# EAGLE schematic QuDAC_V3 (EAGLE 6.6.0)

## Sheet 1 of 14
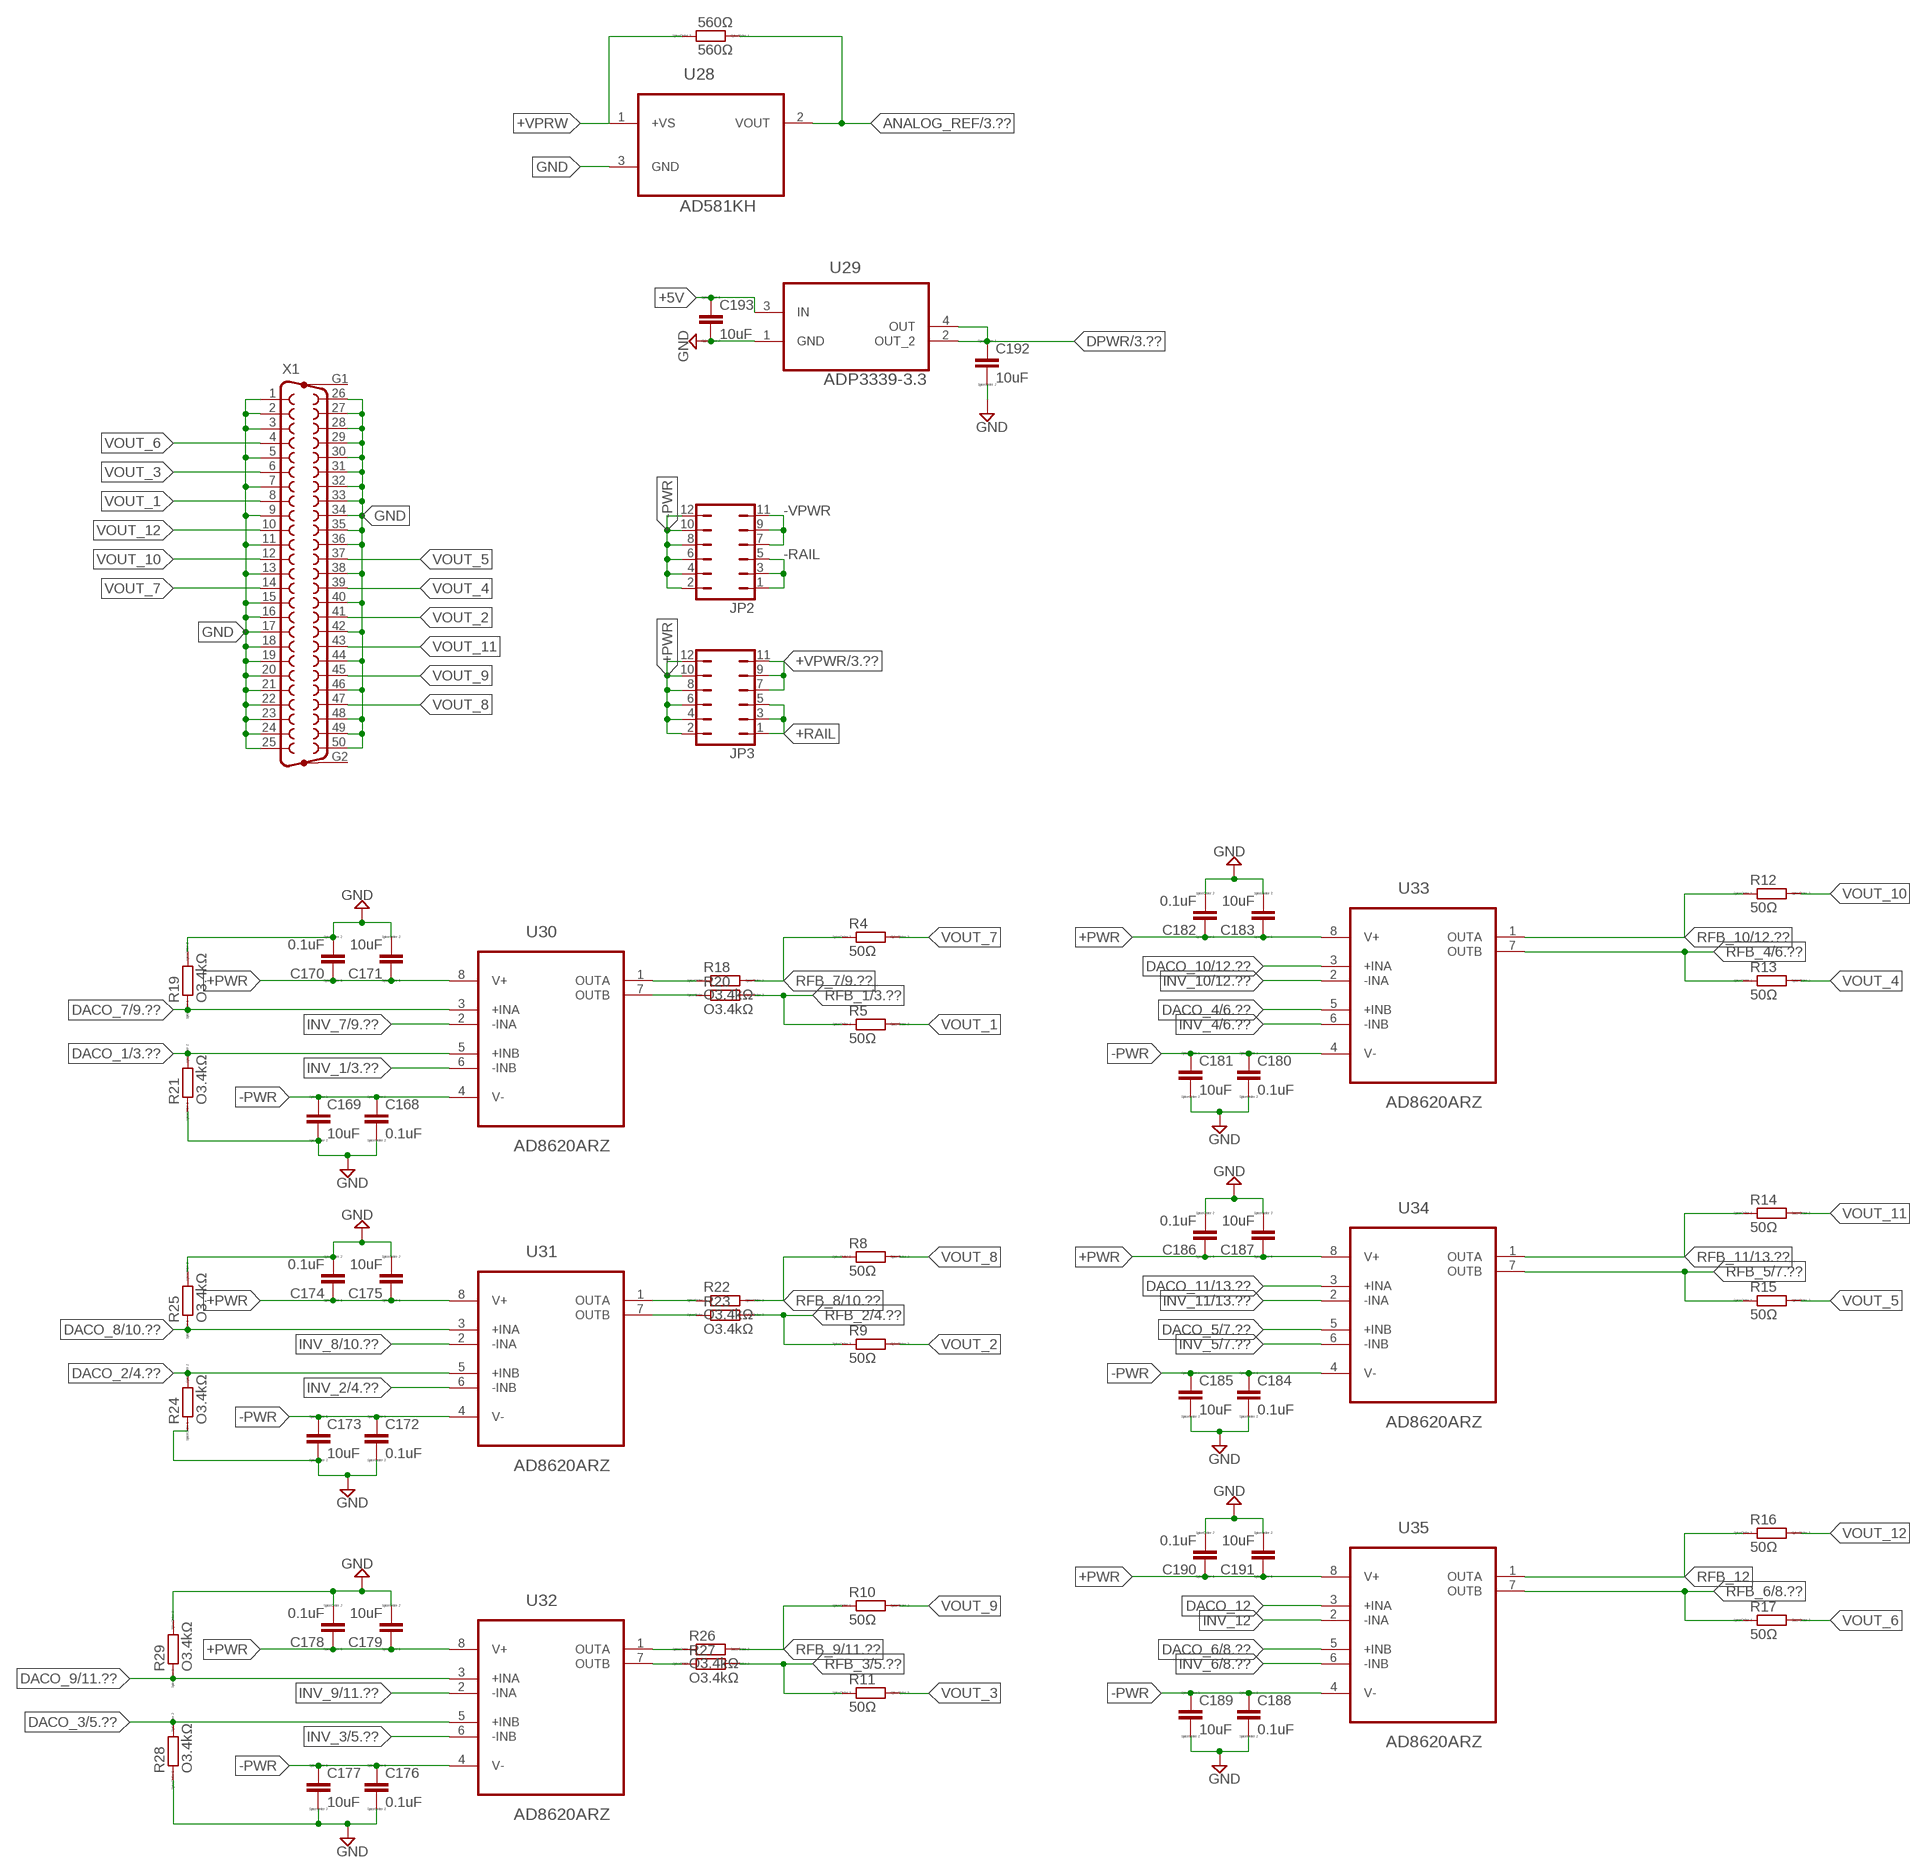
[diagram p0: schematic, sheet 1]

### Parts
560Ω  560Ω  RR0603  [R0603]
C168  0.1uF  CC0603  [C0603]
C169  10uF  C  [C0805]
C170  0.1uF  CC0603  [C0603]
C171  10uF  C  [C0805]
C172  0.1uF  CC0603  [C0603]
C173  10uF  C  [C0805]
C174  0.1uF  CC0603  [C0603]
C175  10uF  C  [C0805]
C176  0.1uF  CC0603  [C0603]
C177  10uF  C  [C0805]
C178  0.1uF  CC0603  [C0603]
C179  10uF  C  [C0805]
C180  0.1uF  CC0603  [C0603]
C181  10uF  C  [C0805]
C182  0.1uF  CC0603  [C0603]
C183  10uF  C  [C0805]
C184  0.1uF  CC0603  [C0603]
C185  10uF  C  [C0805]
C186  0.1uF  CC0603  [C0603]
C187  10uF  C  [C0805]
C188  0.1uF  CC0603  [C0603]
C189  10uF  C  [C0805]
C190  0.1uF  CC0603  [C0603]
C191  10uF  C  [C0805]
C192  10uF  C  [C0805]
C193  10uF  C  [C0805]
JP2  JP6Q  [JP6Q]
JP3  JP6Q  [JP6Q]
R4  50Ω  RR0603  [R0603]
R5  50Ω  RR0603  [R0603]
R8  50Ω  RR0603  [R0603]
R9  50Ω  RR0603  [R0603]
R10  50Ω  RR0603  [R0603]
R11  50Ω  RR0603  [R0603]
R12  50Ω  RR0603  [R0603]
R13  50Ω  RR0603  [R0603]
R14  50Ω  RR0603  [R0603]
R15  50Ω  RR0603  [R0603]
R16  50Ω  RR0603  [R0603]
R17  50Ω  RR0603  [R0603]
R18  O3.4kΩ  RR0603  [R0603]
R19  O3.4kΩ  RR0603  [R0603]
R20  O3.4kΩ  RR0603  [R0603]
R21  O3.4kΩ  RR0603  [R0603]
R22  O3.4kΩ  RR0603  [R0603]
R23  O3.4kΩ  RR0603  [R0603]
R24  O3.4kΩ  RR0603  [R0603]
R25  O3.4kΩ  RR0603  [R0603]
R26  O3.4kΩ  RR0603  [R0603]
R27  O3.4kΩ  RR0603  [R0603]
R28  O3.4kΩ  RR0603  [R0603]
R29  O3.4kΩ  RR0603  [R0603]
U28  AD581KH  [TO254P939X470-3P]
U29  ADP3339-3.3  ADP3339AKCZ-3.3-R7  [SOT230P700X180-4N]
U30  AD8620ARZ  [SOIC127P600X175-8N]
U31  AD8620ARZ  [SOIC127P600X175-8N]
U32  AD8620ARZ  [SOIC127P600X175-8N]
U33  AD8620ARZ  [SOIC127P600X175-8N]
U34  AD8620ARZ  [SOIC127P600X175-8N]
U35  AD8620ARZ  [SOIC127P600X175-8N]
X1  F50HP  [F50HP]

### Nets
+5V: C193.1 U29.3(IN) ; also sheet 2
+PWR: C170.1 C171.1 C174.1 C175.1 C178.1 C179.1 C182.1 C183.1 C186.1 C187.1 C190.1 C191.1 JP3.2 JP3.4 JP3.6 JP3.8 JP3.10 JP3.12 U30.8(V+) U31.8(V+) U32.8(V+) U33.8(V+) U34.8(V+) U35.8(V+)
+RAIL: JP3.1 JP3.3 JP3.5 ; also sheet 2
+VPRW: 560Ω.2 U28.1(+VS)
+VPWR: JP3.7 JP3.9 JP3.11 ; also sheet 2,3,4,5,6,7,8,9,10,11,12,13,14
-PWR: C168.1 C169.1 C172.1 C173.1 C176.1 C177.1 C180.1 C181.1 C184.1 C185.1 C188.1 C189.1 JP2.2 JP2.4 JP2.6 JP2.8 JP2.10 JP2.12 U30.4(V-) U31.4(V-) U32.4(V-) U33.4(V-) U34.4(V-) U35.4(V-)
-RAIL: JP2.1 JP2.3 JP2.5 ; also sheet 2
-VPWR: JP2.7 JP2.9 JP2.11 ; also sheet 2,3,4,5,6,7,8,9,10,11,12,13,14
ANALOG_REF: 560Ω.1 U28.2(VOUT) ; also sheet 3,4,5,6,7,8,9,10,11,12,13,14
DACO_1: R21.2 U30.5(+INB) ; also sheet 3
DACO_2: R24.2 U31.5(+INB) ; also sheet 4
DACO_3: R28.2 U32.5(+INB) ; also sheet 5
DACO_4: U33.5(+INB) ; also sheet 6
DACO_5: U34.5(+INB) ; also sheet 7
DACO_6: U35.5(+INB) ; also sheet 8
DACO_7: R19.1 U30.3(+INA) ; also sheet 9
DACO_8: R25.1 U31.3(+INA) ; also sheet 10
DACO_9: R29.1 U32.3(+INA) ; also sheet 11
DACO_10: U33.3(+INA) ; also sheet 12
DACO_11: U34.3(+INA) ; also sheet 13
DACO_12: U35.3(+INA) ; also sheet 14
DPWR: C192.1 U29.2(OUT_2) U29.4(OUT) ; also sheet 2,3,4,5,6,7,8,9,10,11,12,13,14
GND: C168.2 C169.2 C170.2 C171.2 C172.2 C173.2 C174.2 C175.2 C176.2 C177.2 C178.2 C179.2 C180.2 C181.2 C182.2 C183.2 C184.2 C185.2 C186.2 C187.2 C188.2 C189.2 C190.2 C191.2 C192.2 C193.2 R19.2 R21.1 R24.1 R25.2 R28.1 R29.2 U28.3(GND) U29.1(GND) X1.1 X1.2 X1.3 X1.5 X1.7 X1.9 X1.11 X1.13 X1.15 X1.16 X1.17 X1.18 X1.19 X1.20 X1.21 X1.22 X1.23 X1.24 X1.25 X1.26 X1.27 X1.28 X1.29 X1.30 X1.31 X1.32 X1.33 X1.34 X1.35 X1.36 X1.38 X1.40 X1.42 X1.44 X1.46 X1.48 X1.49 X1.50 ; also sheet 2,3,4,5,6,7,8,9,10,11,12,13,14
INV_1: U30.6(-INB) ; also sheet 3
INV_2: U31.6(-INB) ; also sheet 4
INV_3: U32.6(-INB) ; also sheet 5
INV_4: U33.6(-INB) ; also sheet 6
INV_5: U34.6(-INB) ; also sheet 7
INV_6: U35.6(-INB) ; also sheet 8
INV_7: U30.2(-INA) ; also sheet 9
INV_8: U31.2(-INA) ; also sheet 10
INV_9: U32.2(-INA) ; also sheet 11
INV_10: U33.2(-INA) ; also sheet 12
INV_11: U34.2(-INA) ; also sheet 13
INV_12: U35.2(-INA) ; also sheet 14
N$9: R18.1 U30.1(OUTA)
N$10: R20.1 U30.7(OUTB)
N$11: R23.1 U31.7(OUTB)
N$16: R22.1 U31.1(OUTA)
N$23: R26.1 U32.1(OUTA)
N$24: R27.1 U32.7(OUTB)
RFB_1: R5.1 R20.2 ; also sheet 3
RFB_2: R9.1 R23.2 ; also sheet 4
RFB_3: R11.1 R27.2 ; also sheet 5
RFB_4: R13.1 U33.7(OUTB) ; also sheet 6
RFB_5: R15.1 U34.7(OUTB) ; also sheet 7
RFB_6: R17.1 U35.7(OUTB) ; also sheet 8
RFB_7: R4.1 R18.2 ; also sheet 9
RFB_8: R8.1 R22.2 ; also sheet 10
RFB_9: R10.1 R26.2 ; also sheet 11
RFB_10: R12.1 U33.1(OUTA) ; also sheet 12
RFB_11: R14.1 U34.1(OUTA) ; also sheet 13
RFB_12: R16.1 U35.1(OUTA) ; also sheet 14
VOUT_1: R5.2 X1.8
VOUT_2: R9.2 X1.41
VOUT_3: R11.2 X1.6
VOUT_4: R13.2 X1.39
VOUT_5: R15.2 X1.37
VOUT_6: R17.2 X1.4
VOUT_7: R4.2 X1.14
VOUT_8: R8.2 X1.47
VOUT_9: R10.2 X1.45
VOUT_10: R12.2 X1.12
VOUT_11: R14.2 X1.43
VOUT_12: R16.2 X1.10
Unconnected: X1.G1 X1.G2

## Sheet 2 of 14
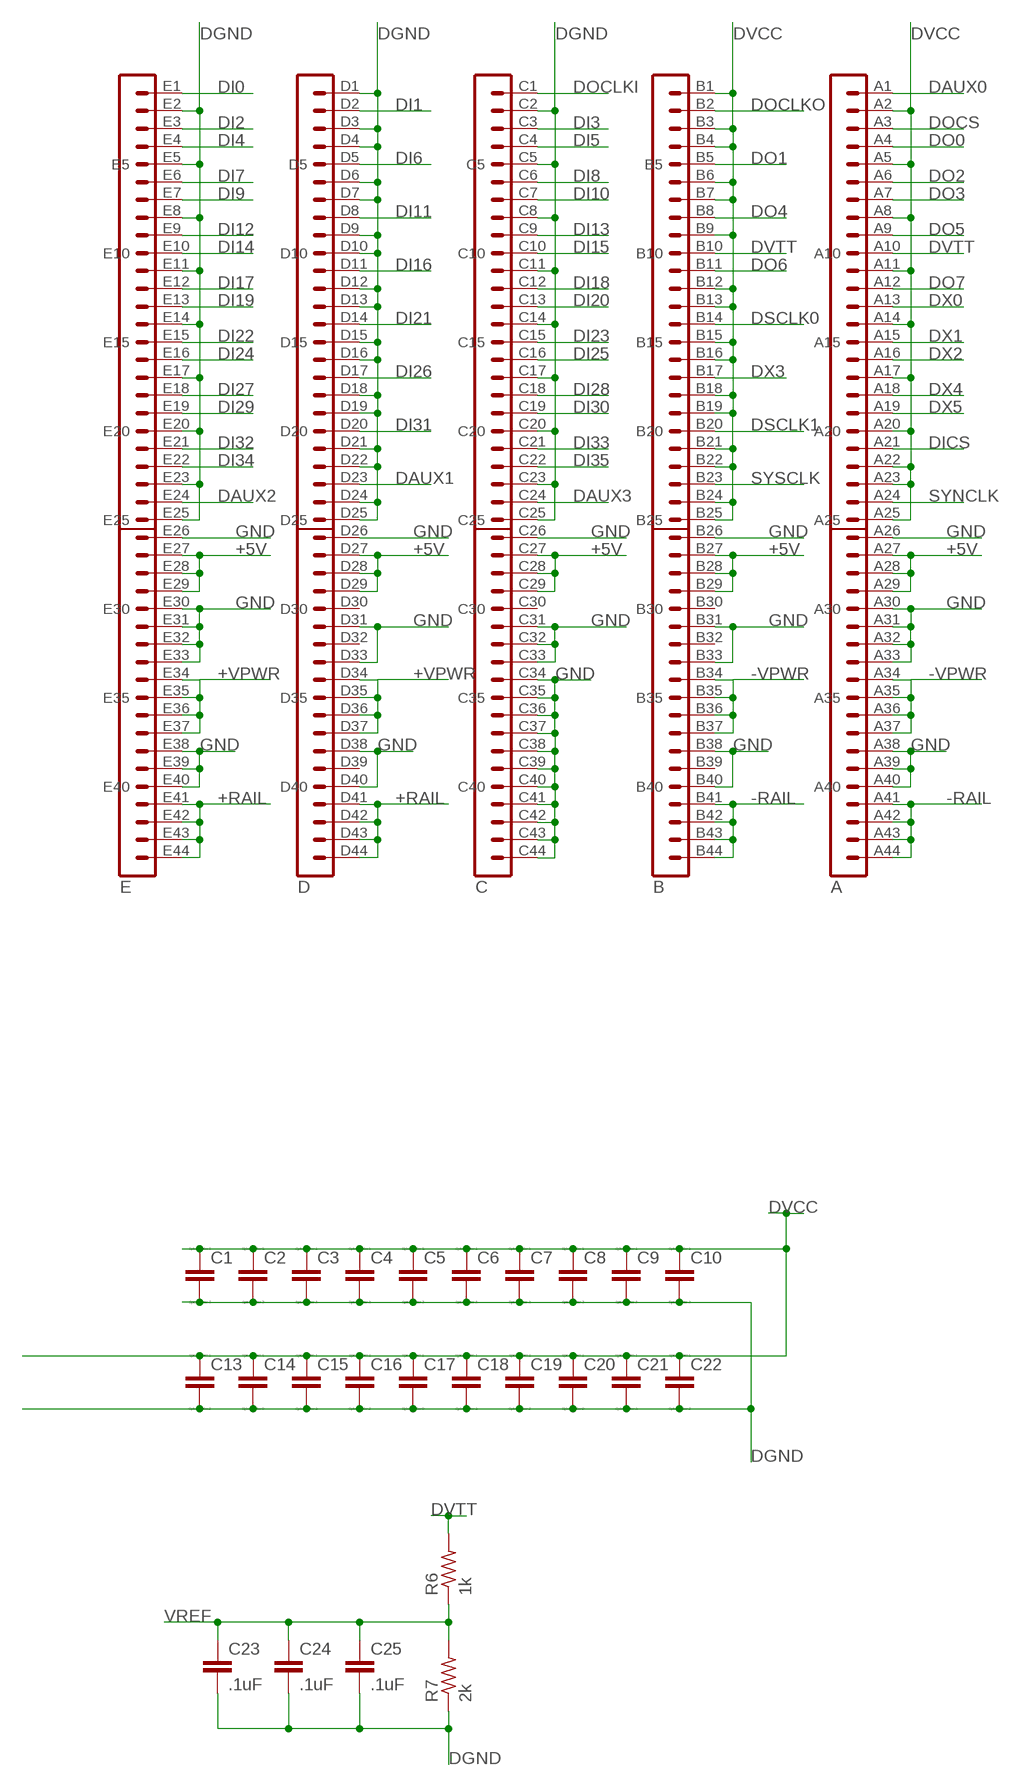
[diagram p1: schematic, sheet 2, part 1 of 2]
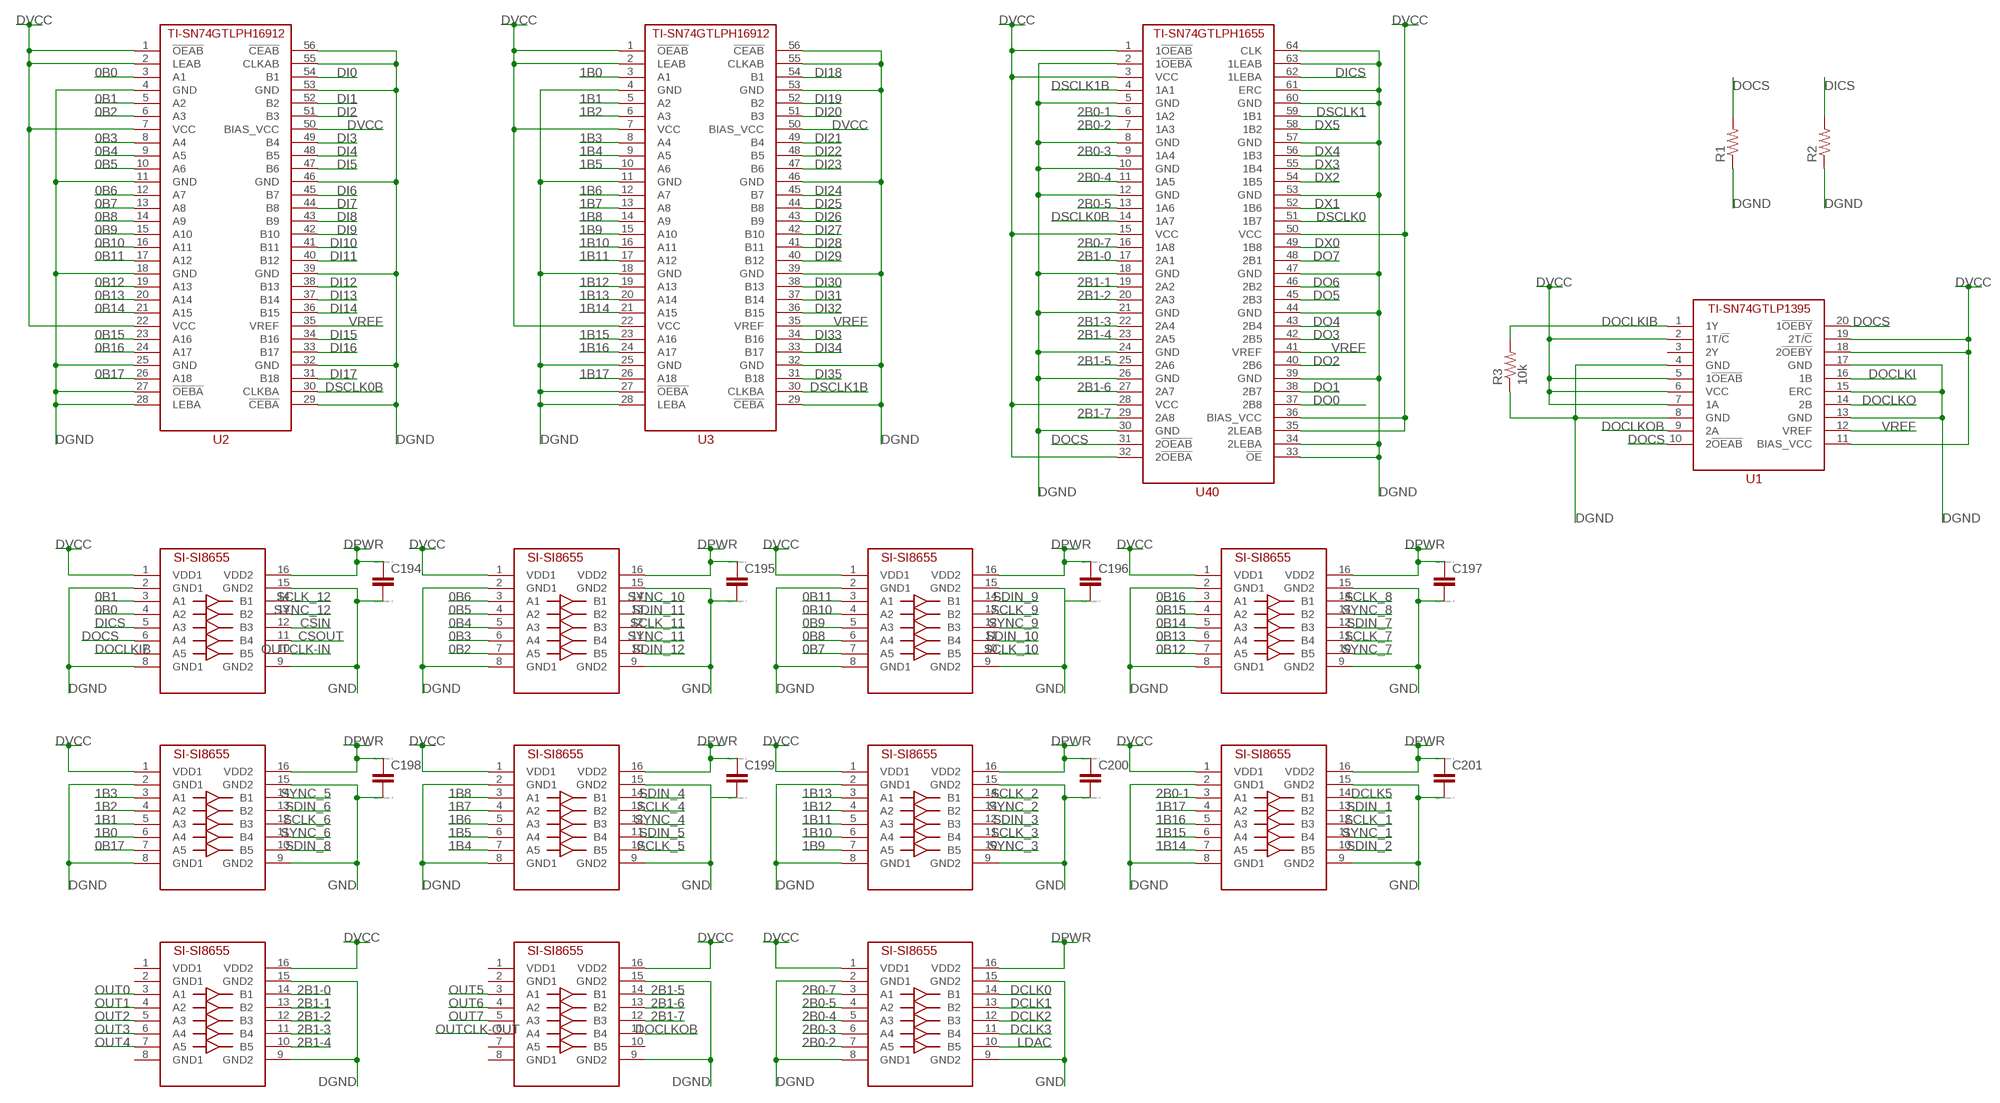
[diagram p2: schematic, sheet 2, part 2 of 2]

### Parts
C1  CC0603  [C0603]
C2  CC0603  [C0603]
C3  CC0603  [C0603]
C4  CC0603  [C0603]
C5  CC0603  [C0603]
C6  CC0603  [C0603]
C7  CC0603  [C0603]
C8  CC0603  [C0603]
C9  CC0603  [C0603]
C10  CC0603  [C0603]
C13  CC0603  [C0603]
C14  CC0603  [C0603]
C15  CC0603  [C0603]
C16  CC0603  [C0603]
C17  CC0603  [C0603]
C18  CC0603  [C0603]
C19  CC0603  [C0603]
C20  CC0603  [C0603]
C21  CC0603  [C0603]
C22  CC0603  [C0603]
C23  .1uF  C-EUC0603  [C0603]
C24  .1uF  C-EUC0603  [C0603]
C25  .1uF  C-EUC0603  [C0603]
C194  CC0603  [C0603]
C195  CC0603  [C0603]
C196  CC0603  [C0603]
C197  CC0603  [C0603]
C198  CC0603  [C0603]
C199  CC0603  [C0603]
C200  CC0603  [C0603]
C201  CC0603  [C0603]
ISO1  SI-SI8655  [QSOP-16]
ISO2  SI-SI8655  [QSOP-16]
ISO3  SI-SI8655  [QSOP-16]
ISO4  SI-SI8655  [QSOP-16]
ISO5  SI-SI8655  [QSOP-16]
ISO6  SI-SI8655  [QSOP-16]
ISO7  SI-SI8655  [QSOP-16]
ISO8  SI-SI8655  [QSOP-16]
ISO9  SI-SI8655  [QSOP-16]
ISO10  SI-SI8655  [QSOP-16]
ISO11  SI-SI8655  [QSOP-16]
J1  EUROCARD-CPCI-220EUROCARD-B19+AB25-NOFRONTDIM  [EUROCARD-CPCI-B19+1B25-NOFRONTDIM]
R1  R-US_R0603  [R0603]
R2  R-US_R0603  [R0603]
R3  10k  R-US_R0603  [R0603]
R6  1k  R-US_R0805  [R0805]
R7  2k  R-US_R0805  [R0805]
U1  TI-SN74GTLP1395  [TSSOP-20]
U2  TI-SN74GTLPH16912  [TSSOP-56]
U3  TI-SN74GTLPH16912  [TSSOP-56]
U40  TI-SN74GTLPH1655  [TSSOP-64]

### Nets
0B0: ISO1.4(A2) U2.3(A1)
0B1: ISO1.3(A1) U2.5(A2)
0B2: ISO2.7(A5) U2.6(A3)
0B3: ISO2.6(A4) U2.8(A4)
0B4: ISO2.5(A3) U2.9(A5)
0B5: ISO2.4(A2) U2.10(A6)
0B6: ISO2.3(A1) U2.12(A7)
0B7: ISO3.7(A5) U2.13(A8)
0B8: ISO3.6(A4) U2.14(A9)
0B9: ISO3.5(A3) U2.15(A10)
0B10: ISO3.4(A2) U2.16(A11)
0B11: ISO3.3(A1) U2.17(A12)
0B12: ISO4.7(A5) U2.19(A13)
0B13: ISO4.6(A4) U2.20(A14)
0B14: ISO4.5(A3) U2.21(A15)
0B15: ISO4.4(A2) U2.23(A16)
0B16: ISO4.3(A1) U2.24(A17)
0B17: ISO5.7(A5) U2.26(A18)
1B0: ISO5.6(A4) U3.3(A1)
1B1: ISO5.5(A3) U3.5(A2)
1B2: ISO5.4(A2) U3.6(A3)
1B3: ISO5.3(A1) U3.8(A4)
1B4: ISO6.7(A5) U3.9(A5)
1B5: ISO6.6(A4) U3.10(A6)
1B6: ISO6.5(A3) U3.12(A7)
1B7: ISO6.4(A2) U3.13(A8)
1B8: ISO6.3(A1) U3.14(A9)
1B9: ISO7.7(A5) U3.15(A10)
1B10: ISO7.6(A4) U3.16(A11)
1B11: ISO7.5(A3) U3.17(A12)
1B12: ISO7.4(A2) U3.19(A13)
1B13: ISO7.3(A1) U3.20(A14)
1B14: ISO8.7(A5) U3.21(A15)
1B15: ISO8.6(A4) U3.23(A16)
1B16: ISO8.5(A3) U3.24(A17)
1B17: ISO8.4(A2) U3.26(A18)
2B0-1: ISO8.3(A1) U40.6(1A2)
2B0-2: ISO11.7(A5) U40.7(1A3)
2B0-3: ISO11.6(A4) U40.9(1A4)
2B0-4: ISO11.5(A3) U40.11(1A5)
2B0-5: ISO11.4(A2) U40.13(1A6)
2B0-7: ISO11.3(A1) U40.16(1A8)
2B1-0: ISO9.14(B1) U40.17(2A1)
2B1-1: ISO9.13(B2) U40.19(2A2)
2B1-2: ISO9.12(B3) U40.20(2A3)
2B1-3: ISO9.11(B4) U40.22(2A4)
2B1-4: ISO9.10(B5) U40.23(2A5)
2B1-5: ISO10.14(B1) U40.25(2A6)
2B1-6: ISO10.13(B2) U40.27(2A7)
2B1-7: ISO10.12(B3) U40.29(2A8)
+5V: J1.A27 J1.A28 J1.A29 J1.B27 J1.B28 J1.B29 J1.C27 J1.C28 J1.C29 J1.D27 J1.D28 J1.D29 J1.E27 J1.E28 J1.E29 ; also sheet 1
+RAIL: J1.D41 J1.D42 J1.D43 J1.D44 J1.E41 J1.E42 J1.E43 J1.E44 ; also sheet 1
+VPWR: J1.D34 J1.D35 J1.D36 J1.D37 J1.E34 J1.E35 J1.E36 J1.E37 ; also sheet 1,3,4,5,6,7,8,9,10,11,12,13,14
-RAIL: J1.A41 J1.A42 J1.A43 J1.A44 J1.B41 J1.B42 J1.B43 J1.B44 ; also sheet 1
-VPWR: J1.A34 J1.A35 J1.A36 J1.A37 J1.B34 J1.B35 J1.B36 J1.B37 ; also sheet 1,3,4,5,6,7,8,9,10,11,12,13,14
CSIN: ISO1.12(B3)
CSOUT: ISO1.11(B4)
DAUX0: J1.A1
DAUX1: J1.D23
DAUX2: J1.E24
DAUX3: J1.C24
DCLK0: ISO11.14(B1)
DCLK1: ISO11.13(B2)
DCLK2: ISO11.12(B3)
DCLK3: ISO11.11(B4)
DCLK5: ISO8.14(B1)
DGND: C1.2 C2.2 C3.2 C4.2 C5.2 C6.2 C7.2 C8.2 C9.2 C10.2 C13.2 C14.2 C15.2 C16.2 C17.2 C18.2 C19.2 C20.2 C21.2 C22.2 C23.2 C24.2 C25.2 ISO1.2(GND1) ISO1.8(GND1) ISO2.2(GND1) ISO2.8(GND1) ISO3.2(GND1) ISO3.8(GND1) ISO4.2(GND1) ISO4.8(GND1) ISO5.2(GND1) ISO5.8(GND1) ISO6.2(GND1) ISO6.8(GND1) ISO7.2(GND1) ISO7.8(GND1) ISO8.2(GND1) ISO8.8(GND1) ISO9.9(GND2) ISO9.15(GND2) ISO10.9(GND2) ISO10.15(GND2) ISO11.2(GND1) ISO11.8(GND1) J1.C2 J1.C5 J1.C8 J1.C11 J1.C14 J1.C17 J1.C20 J1.C23 J1.C25 J1.D1 J1.D3 J1.D4 J1.D6 J1.D7 J1.D9 J1.D10 J1.D12 J1.D13 J1.D15 J1.D16 J1.D18 J1.D19 J1.D21 J1.D22 J1.D24 J1.D25 J1.E2 J1.E5 J1.E8 J1.E11 J1.E14 J1.E17 J1.E20 J1.E23 J1.E25 R1.1 R2.1 R3.1 R7.1 U1.4(GND) U1.8(GND) U1.13(GND) U1.15(ERC) U1.17(GND) U2.4(GND) U2.11(GND) U2.18(GND) U2.25(GND) U2.27(!OEBA) U2.28(LEBA) U2.29(!CEBA) U2.32(GND) U2.39(GND) U2.46(GND) U2.53(GND) U2.55(CLKAB) U2.56(!CEAB) U3.4(GND) U3.11(GND) U3.18(GND) U3.25(GND) U3.27(!OEBA) U3.28(LEBA) U3.29(!CEBA) U3.32(GND) U3.39(GND) U3.46(GND) U3.53(GND) U3.55(CLKAB) U3.56(!CEAB) U40.2(1!OEBA) U40.5(GND) U40.8(GND) U40.10(GND) U40.12(GND) U40.18(GND) U40.21(GND) U40.24(GND) U40.26(GND) U40.30(GND) U40.33(!OE) U40.34(2LEBA) U40.39(GND) U40.44(GND) U40.47(GND) U40.53(GND) U40.57(GND) U40.60(GND) U40.61(ERC) U40.63(1LEAB) U40.64(CLK)
DI0: J1.E1 U2.54(B1)
DI1: J1.D2 U2.52(B2)
DI2: J1.E3 U2.51(B3)
DI3: J1.C3 U2.49(B4)
DI4: J1.E4 U2.48(B5)
DI5: J1.C4 U2.47(B6)
DI6: J1.D5 U2.45(B7)
DI7: J1.E6 U2.44(B8)
DI8: J1.C6 U2.43(B9)
DI9: J1.E7 U2.42(B10)
DI10: J1.C7 U2.41(B11)
DI11: J1.D8 U2.40(B12)
DI12: J1.E9 U2.38(B13)
DI13: J1.C9 U2.37(B14)
DI14: J1.E10 U2.36(B15)
DI15: J1.C10 U2.34(B16)
DI16: J1.D11 U2.33(B17)
DI17: J1.E12 U2.31(B18)
DI18: J1.C12 U3.54(B1)
DI19: J1.E13 U3.52(B2)
DI20: J1.C13 U3.51(B3)
DI21: J1.D14 U3.49(B4)
DI22: J1.E15 U3.48(B5)
DI23: J1.C15 U3.47(B6)
DI24: J1.E16 U3.45(B7)
DI25: J1.C16 U3.44(B8)
DI26: J1.D17 U3.43(B9)
DI27: J1.E18 U3.42(B10)
DI28: J1.C18 U3.41(B11)
DI29: J1.E19 U3.40(B12)
DI30: J1.C19 U3.38(B13)
DI31: J1.D20 U3.37(B14)
DI32: J1.E21 U3.36(B15)
DI33: J1.C21 U3.34(B16)
DI34: J1.E22 U3.33(B17)
DI35: J1.C22 U3.31(B18)
DICS: ISO1.5(A3) J1.A21 R2.2 U40.62(1LEBA)
DO0: J1.A4 U40.37(2B8)
DO1: J1.B5 U40.38(2B7)
DO2: J1.A6 U40.40(2B6)
DO3: J1.A7 U40.42(2B5)
DO4: J1.B8 U40.43(2B4)
DO5: J1.A9 U40.45(2B3)
DO6: J1.B11 U40.46(2B2)
DO7: J1.A12 U40.48(2B1)
DOCLKI: J1.C1 U1.16(1B)
DOCLKIB: ISO1.7(A5) R3.2 U1.1(1Y)
DOCLKO: J1.B2 U1.14(2B)
DOCLKOB: ISO10.11(B4) U1.9(2A)
DOCS: ISO1.6(A4) J1.A3 R1.2 U1.10(2!OEAB) U1.20(1!OEBY) U40.31(2!OEAB)
DPWR: C194.1 C195.1 C196.1 C197.1 C198.1 C199.1 C200.1 C201.1 ISO1.16(VDD2) ISO2.16(VDD2) ISO3.16(VDD2) ISO4.16(VDD2) ISO5.16(VDD2) ISO6.16(VDD2) ISO7.16(VDD2) ISO8.16(VDD2) ISO11.16(VDD2) ; also sheet 1,3,4,5,6,7,8,9,10,11,12,13,14
DSCLK0: J1.B14 U40.51(1B7)
DSCLK0B: U2.30(CLKBA) U40.14(1A7)
DSCLK1: J1.B20 U40.59(1B1)
DSCLK1B: U3.30(CLKBA) U40.4(1A1)
DVCC: C1.1 C2.1 C3.1 C4.1 C5.1 C6.1 C7.1 C8.1 C9.1 C10.1 C13.1 C14.1 C15.1 C16.1 C17.1 C18.1 C19.1 C20.1 C21.1 C22.1 ISO1.1(VDD1) ISO2.1(VDD1) ISO3.1(VDD1) ISO4.1(VDD1) ISO5.1(VDD1) ISO6.1(VDD1) ISO7.1(VDD1) ISO8.1(VDD1) ISO9.16(VDD2) ISO10.16(VDD2) ISO11.1(VDD1) J1.A2 J1.A5 J1.A8 J1.A11 J1.A14 J1.A17 J1.A20 J1.A22 J1.A23 J1.A25 J1.B1 J1.B3 J1.B4 J1.B6 J1.B7 J1.B9 J1.B12 J1.B13 J1.B15 J1.B16 J1.B18 J1.B19 J1.B21 J1.B22 J1.B24 J1.B25 U1.2(1T/!C) U1.5(1!OEAB) U1.6(VCC) U1.7(1A) U1.11(BIAS_VCC) U1.18(2!OEBY) U1.19(2T/!C) U2.1(!OEAB) U2.2(LEAB) U2.7(VCC) U2.22(VCC) U2.50(BIAS_VCC) U3.1(!OEAB) U3.2(LEAB) U3.7(VCC) U3.22(VCC) U3.50(BIAS_VCC) U40.1(1!OEAB) U40.3(VCC) U40.15(VCC) U40.28(VCC) U40.32(2!OEBA) U40.35(2LEAB) U40.36(BIAS_VCC) U40.50(VCC)
DVTT: J1.A10 J1.B10 R6.2
DX0: J1.A13 U40.49(1B8)
DX1: J1.A15 U40.52(1B6)
DX2: J1.A16 U40.54(1B5)
DX3: J1.B17 U40.55(1B4)
DX4: J1.A18 U40.56(1B3)
DX5: J1.A19 U40.58(1B2)
GND: C194.2 C195.2 C196.2 C197.2 C198.2 C199.2 C200.2 C201.2 ISO1.9(GND2) ISO1.15(GND2) ISO2.9(GND2) ISO2.15(GND2) ISO3.9(GND2) ISO3.15(GND2) ISO4.9(GND2) ISO4.15(GND2) ISO5.9(GND2) ISO5.15(GND2) ISO6.9(GND2) ISO6.15(GND2) ISO7.9(GND2) ISO7.15(GND2) ISO8.9(GND2) ISO8.15(GND2) ISO11.9(GND2) ISO11.15(GND2) J1.A26 J1.A30 J1.A31 J1.A32 J1.A33 J1.A38 J1.A39 J1.A40 J1.B26 J1.B31 J1.B33 J1.B38 J1.B40 J1.C26 J1.C31 J1.C32 J1.C33 J1.C34 J1.C35 J1.C36 J1.C37 J1.C38 J1.C39 J1.C40 J1.C41 J1.C42 J1.C43 J1.C44 J1.D26 J1.D31 J1.D33 J1.D38 J1.D40 J1.E26 J1.E30 J1.E31 J1.E32 J1.E33 J1.E38 J1.E39 J1.E40 ; also sheet 1,3,4,5,6,7,8,9,10,11,12,13,14
LDAC: ISO11.10(B5) ; also sheet 3,4,5,6,7,8,9,10,11,12,13,14
OUT0: ISO9.3(A1)
OUT1: ISO9.4(A2)
OUT2: ISO9.5(A3)
OUT3: ISO9.6(A4)
OUT4: ISO9.7(A5)
OUT5: ISO10.3(A1)
OUT6: ISO10.4(A2)
OUT7: ISO10.5(A3)
OUTCLK-IN: ISO1.10(B5)
OUTCLK-OUT: ISO10.6(A4)
SCLK_1: ISO8.12(B3) ; also sheet 3
SCLK_2: ISO7.14(B1) ; also sheet 4
SCLK_3: ISO7.11(B4) ; also sheet 5
SCLK_4: ISO6.13(B2) ; also sheet 6
SCLK_5: ISO6.10(B5) ; also sheet 7
SCLK_6: ISO5.12(B3) ; also sheet 8
SCLK_7: ISO4.11(B4) ; also sheet 9
SCLK_8: ISO4.14(B1) ; also sheet 10
SCLK_9: ISO3.13(B2) ; also sheet 11
SCLK_10: ISO3.10(B5) ; also sheet 12
SCLK_11: ISO2.12(B3) ; also sheet 13
SCLK_12: ISO1.14(B1) ; also sheet 14
SDIN_1: ISO8.13(B2) ; also sheet 3
SDIN_2: ISO8.10(B5) ; also sheet 4
SDIN_3: ISO7.12(B3) ; also sheet 5
SDIN_4: ISO6.14(B1) ; also sheet 6
SDIN_5: ISO6.11(B4) ; also sheet 7
SDIN_6: ISO5.13(B2) ; also sheet 8
SDIN_7: ISO4.12(B3) ; also sheet 9
SDIN_8: ISO5.10(B5) ; also sheet 10
SDIN_9: ISO3.14(B1) ; also sheet 11
SDIN_10: ISO3.11(B4) ; also sheet 12
SDIN_11: ISO2.13(B2) ; also sheet 13
SDIN_12: ISO2.10(B5) ; also sheet 14
SYNC_1: ISO8.11(B4) ; also sheet 3
SYNC_2: ISO7.13(B2) ; also sheet 4
SYNC_3: ISO7.10(B5) ; also sheet 5
SYNC_4: ISO6.12(B3) ; also sheet 6
SYNC_5: ISO5.14(B1) ; also sheet 7
SYNC_6: ISO5.11(B4) ; also sheet 8
SYNC_7: ISO4.10(B5) ; also sheet 9
SYNC_8: ISO4.13(B2) ; also sheet 10
SYNC_9: ISO3.12(B3) ; also sheet 11
SYNC_10: ISO2.14(B1) ; also sheet 12
SYNC_11: ISO2.11(B4) ; also sheet 13
SYNC_12: ISO1.13(B2) ; also sheet 14
SYNCLK: J1.A24
SYSCLK: J1.B23
VREF: C23.1 C24.1 C25.1 R6.1 R7.2 U1.12(VREF) U2.35(VREF) U3.35(VREF) U40.41(VREF)
Unconnected: ISO9.1(VDD1) ISO9.2(GND1) ISO9.8(GND1) ISO10.1(VDD1) ISO10.2(GND1) ISO10.7(A5) ISO10.8(GND1) ISO10.10(B5) J1.B30 J1.B32 J1.B39 J1.C30 J1.D30 J1.D32 J1.D39 U1.3(2Y)

## Sheet 3 of 14
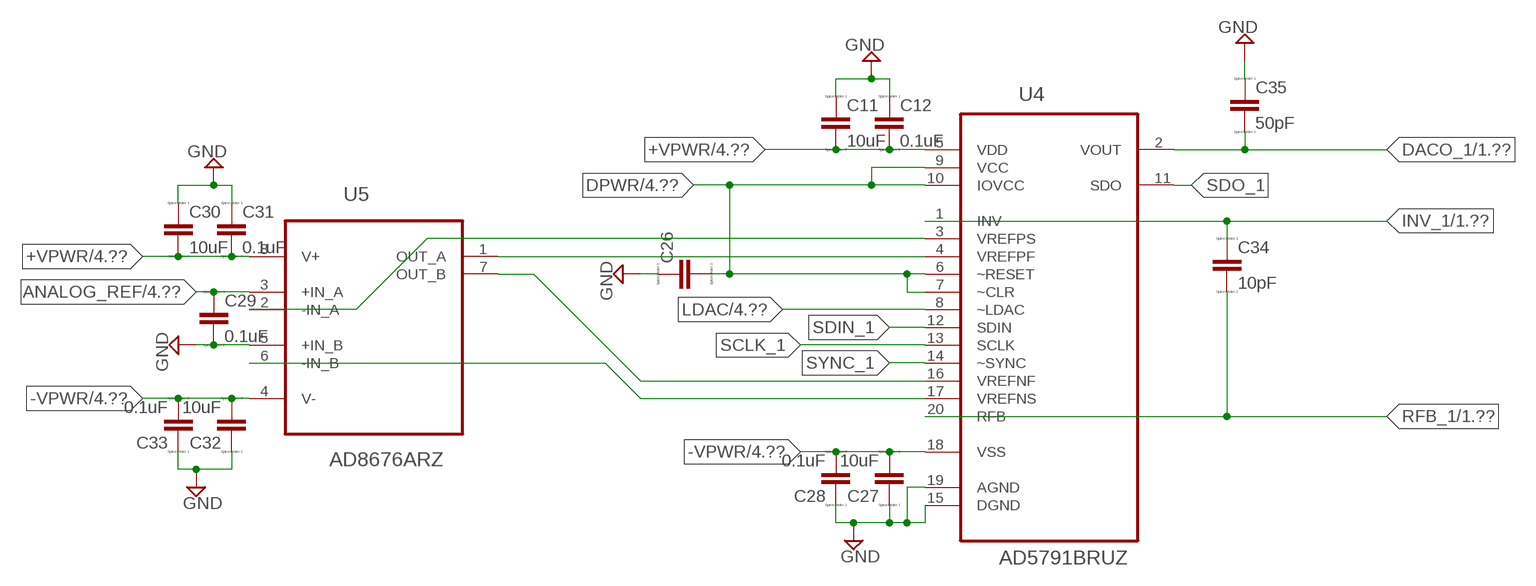
[diagram p3: schematic, sheet 3]

### Parts
C11  10uF  C  [C0805]
C12  0.1uF  CC0603  [C0603]
C26  CC0603  [C0603]
C27  10uF  C  [C0805]
C28  0.1uF  CC0603  [C0603]
C29  0.1uF  CC0603  [C0603]
C30  10uF  C  [C0805]
C31  0.1uF  CC0603  [C0603]
C32  10uF  C  [C0805]
C33  0.1uF  CC0603  [C0603]
C34  10pF  CC0603  [C0603]
C35  50pF  CC0603  [C0603]
U4  AD5791BRUZ  [SOP65P640X120-20N]
U5  AD8676ARZ  [SOIC127P600X175-8N]

### Nets
+VPWR: C11.2 C12.2 C30.2 C31.2 U4.5(VDD) U5.8(V+) ; also sheet 1,2,4,5,6,7,8,9,10,11,12,13,14
-VPWR: C27.2 C28.2 C32.2 C33.2 U4.18(VSS) U5.4(V-) ; also sheet 1,2,4,5,6,7,8,9,10,11,12,13,14
ANALOG_REF: C29.1 U5.3(+IN_A) ; also sheet 1,4,5,6,7,8,9,10,11,12,13,14
DACO_1: C35.2 U4.2(VOUT) ; also sheet 1
DPWR: C26.2 U4.6(~RESET) U4.7(~CLR) U4.9(VCC) U4.10(IOVCC) ; also sheet 1,2,4,5,6,7,8,9,10,11,12,13,14
GND: C11.1 C12.1 C26.1 C27.1 C28.1 C29.2 C30.1 C31.1 C32.1 C33.1 C35.1 U4.15(DGND) U4.19(AGND) U5.5(+IN_B) ; also sheet 1,2,4,5,6,7,8,9,10,11,12,13,14
INV_1: C34.1 U4.1(INV) ; also sheet 1
LDAC: U4.8(~LDAC) ; also sheet 2,4,5,6,7,8,9,10,11,12,13,14
N$4: U4.4(VREFPF) U5.1(OUT_A)
N$6: U4.16(VREFNF) U5.7(OUT_B)
N$7: U4.3(VREFPS) U5.2(-IN_A)
N$8: U4.17(VREFNS) U5.6(-IN_B)
RFB_1: C34.2 U4.20(RFB) ; also sheet 1
SCLK_1: U4.13(SCLK) ; also sheet 2
SDIN_1: U4.12(SDIN) ; also sheet 2
SDO_1: U4.11(SDO)
SYNC_1: U4.14(~SYNC) ; also sheet 2

## Sheet 4 of 14
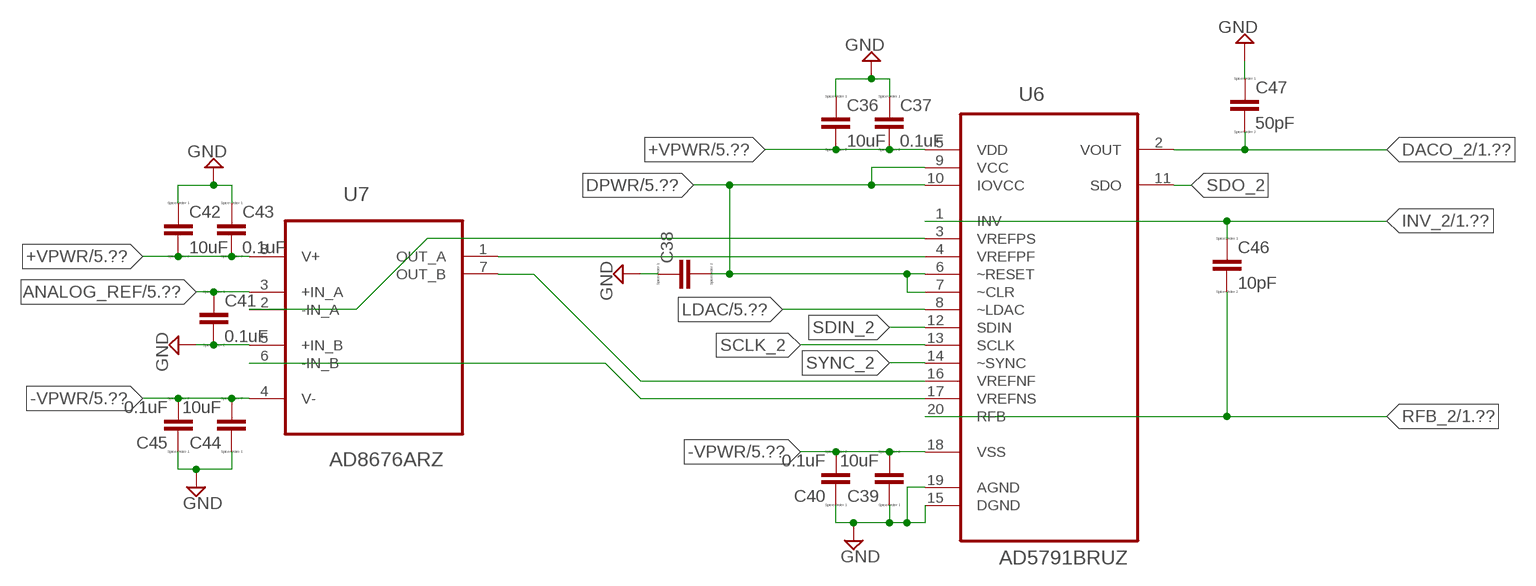
[diagram p4: schematic, sheet 4]

### Parts
C36  10uF  C  [C0805]
C37  0.1uF  CC0603  [C0603]
C38  CC0603  [C0603]
C39  10uF  C  [C0805]
C40  0.1uF  CC0603  [C0603]
C41  0.1uF  CC0603  [C0603]
C42  10uF  C  [C0805]
C43  0.1uF  CC0603  [C0603]
C44  10uF  C  [C0805]
C45  0.1uF  CC0603  [C0603]
C46  10pF  CC0603  [C0603]
C47  50pF  CC0603  [C0603]
U6  AD5791BRUZ  [SOP65P640X120-20N]
U7  AD8676ARZ  [SOIC127P600X175-8N]

### Nets
+VPWR: C36.2 C37.2 C42.2 C43.2 U6.5(VDD) U7.8(V+) ; also sheet 1,2,3,5,6,7,8,9,10,11,12,13,14
-VPWR: C39.2 C40.2 C44.2 C45.2 U6.18(VSS) U7.4(V-) ; also sheet 1,2,3,5,6,7,8,9,10,11,12,13,14
ANALOG_REF: C41.1 U7.3(+IN_A) ; also sheet 1,3,5,6,7,8,9,10,11,12,13,14
DACO_2: C47.2 U6.2(VOUT) ; also sheet 1
DPWR: C38.2 U6.6(~RESET) U6.7(~CLR) U6.9(VCC) U6.10(IOVCC) ; also sheet 1,2,3,5,6,7,8,9,10,11,12,13,14
GND: C36.1 C37.1 C38.1 C39.1 C40.1 C41.2 C42.1 C43.1 C44.1 C45.1 C47.1 U6.15(DGND) U6.19(AGND) U7.5(+IN_B) ; also sheet 1,2,3,5,6,7,8,9,10,11,12,13,14
INV_2: C46.1 U6.1(INV) ; also sheet 1
LDAC: U6.8(~LDAC) ; also sheet 2,3,5,6,7,8,9,10,11,12,13,14
N$12: U6.4(VREFPF) U7.1(OUT_A)
N$13: U6.16(VREFNF) U7.7(OUT_B)
N$14: U6.3(VREFPS) U7.2(-IN_A)
N$15: U6.17(VREFNS) U7.6(-IN_B)
RFB_2: C46.2 U6.20(RFB) ; also sheet 1
SCLK_2: U6.13(SCLK) ; also sheet 2
SDIN_2: U6.12(SDIN) ; also sheet 2
SDO_2: U6.11(SDO)
SYNC_2: U6.14(~SYNC) ; also sheet 2

## Sheet 5 of 14
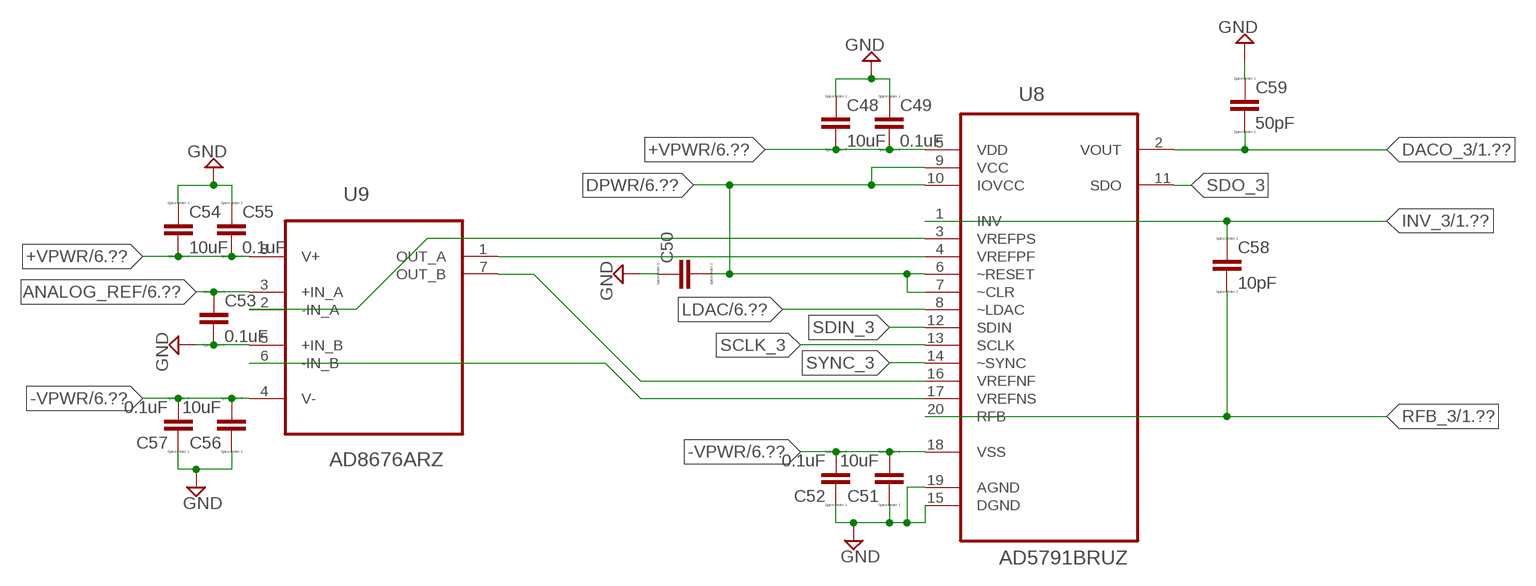
[diagram p5: schematic, sheet 5]

### Parts
C48  10uF  C  [C0805]
C49  0.1uF  CC0603  [C0603]
C50  CC0603  [C0603]
C51  10uF  C  [C0805]
C52  0.1uF  CC0603  [C0603]
C53  0.1uF  CC0603  [C0603]
C54  10uF  C  [C0805]
C55  0.1uF  CC0603  [C0603]
C56  10uF  C  [C0805]
C57  0.1uF  CC0603  [C0603]
C58  10pF  CC0603  [C0603]
C59  50pF  CC0603  [C0603]
U8  AD5791BRUZ  [SOP65P640X120-20N]
U9  AD8676ARZ  [SOIC127P600X175-8N]

### Nets
+VPWR: C48.2 C49.2 C54.2 C55.2 U8.5(VDD) U9.8(V+) ; also sheet 1,2,3,4,6,7,8,9,10,11,12,13,14
-VPWR: C51.2 C52.2 C56.2 C57.2 U8.18(VSS) U9.4(V-) ; also sheet 1,2,3,4,6,7,8,9,10,11,12,13,14
ANALOG_REF: C53.1 U9.3(+IN_A) ; also sheet 1,3,4,6,7,8,9,10,11,12,13,14
DACO_3: C59.2 U8.2(VOUT) ; also sheet 1
DPWR: C50.2 U8.6(~RESET) U8.7(~CLR) U8.9(VCC) U8.10(IOVCC) ; also sheet 1,2,3,4,6,7,8,9,10,11,12,13,14
GND: C48.1 C49.1 C50.1 C51.1 C52.1 C53.2 C54.1 C55.1 C56.1 C57.1 C59.1 U8.15(DGND) U8.19(AGND) U9.5(+IN_B) ; also sheet 1,2,3,4,6,7,8,9,10,11,12,13,14
INV_3: C58.1 U8.1(INV) ; also sheet 1
LDAC: U8.8(~LDAC) ; also sheet 2,3,4,6,7,8,9,10,11,12,13,14
N$19: U8.4(VREFPF) U9.1(OUT_A)
N$20: U8.16(VREFNF) U9.7(OUT_B)
N$21: U8.3(VREFPS) U9.2(-IN_A)
N$22: U8.17(VREFNS) U9.6(-IN_B)
RFB_3: C58.2 U8.20(RFB) ; also sheet 1
SCLK_3: U8.13(SCLK) ; also sheet 2
SDIN_3: U8.12(SDIN) ; also sheet 2
SDO_3: U8.11(SDO)
SYNC_3: U8.14(~SYNC) ; also sheet 2

## Sheet 6 of 14
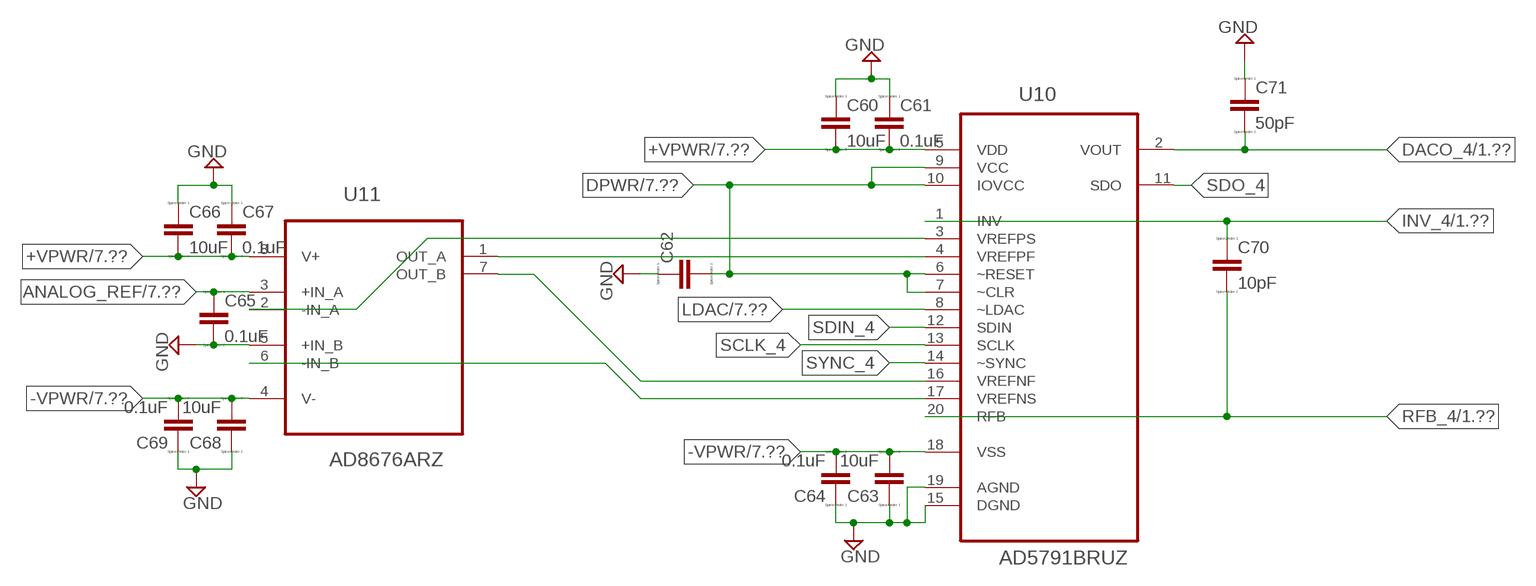
[diagram p6: schematic, sheet 6]

### Parts
C60  10uF  C  [C0805]
C61  0.1uF  CC0603  [C0603]
C62  CC0603  [C0603]
C63  10uF  C  [C0805]
C64  0.1uF  CC0603  [C0603]
C65  0.1uF  CC0603  [C0603]
C66  10uF  C  [C0805]
C67  0.1uF  CC0603  [C0603]
C68  10uF  C  [C0805]
C69  0.1uF  CC0603  [C0603]
C70  10pF  CC0603  [C0603]
C71  50pF  CC0603  [C0603]
U10  AD5791BRUZ  [SOP65P640X120-20N]
U11  AD8676ARZ  [SOIC127P600X175-8N]

### Nets
+VPWR: C60.2 C61.2 C66.2 C67.2 U10.5(VDD) U11.8(V+) ; also sheet 1,2,3,4,5,7,8,9,10,11,12,13,14
-VPWR: C63.2 C64.2 C68.2 C69.2 U10.18(VSS) U11.4(V-) ; also sheet 1,2,3,4,5,7,8,9,10,11,12,13,14
ANALOG_REF: C65.1 U11.3(+IN_A) ; also sheet 1,3,4,5,7,8,9,10,11,12,13,14
DACO_4: C71.2 U10.2(VOUT) ; also sheet 1
DPWR: C62.2 U10.6(~RESET) U10.7(~CLR) U10.9(VCC) U10.10(IOVCC) ; also sheet 1,2,3,4,5,7,8,9,10,11,12,13,14
GND: C60.1 C61.1 C62.1 C63.1 C64.1 C65.2 C66.1 C67.1 C68.1 C69.1 C71.1 U10.15(DGND) U10.19(AGND) U11.5(+IN_B) ; also sheet 1,2,3,4,5,7,8,9,10,11,12,13,14
INV_4: C70.1 U10.1(INV) ; also sheet 1
LDAC: U10.8(~LDAC) ; also sheet 2,3,4,5,7,8,9,10,11,12,13,14
N$31: U10.4(VREFPF) U11.1(OUT_A)
N$32: U10.16(VREFNF) U11.7(OUT_B)
N$33: U10.3(VREFPS) U11.2(-IN_A)
N$34: U10.17(VREFNS) U11.6(-IN_B)
RFB_4: C70.2 U10.20(RFB) ; also sheet 1
SCLK_4: U10.13(SCLK) ; also sheet 2
SDIN_4: U10.12(SDIN) ; also sheet 2
SDO_4: U10.11(SDO)
SYNC_4: U10.14(~SYNC) ; also sheet 2

## Sheet 7 of 14
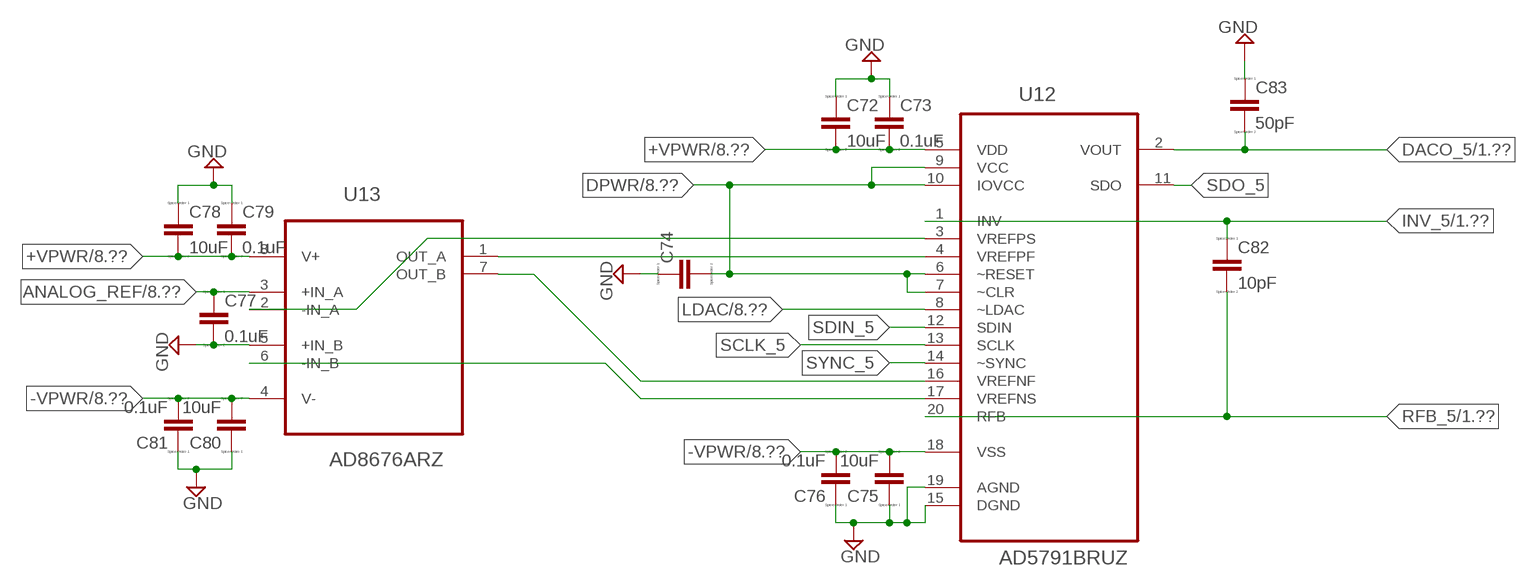
[diagram p7: schematic, sheet 7]

### Parts
C72  10uF  C  [C0805]
C73  0.1uF  CC0603  [C0603]
C74  CC0603  [C0603]
C75  10uF  C  [C0805]
C76  0.1uF  CC0603  [C0603]
C77  0.1uF  CC0603  [C0603]
C78  10uF  C  [C0805]
C79  0.1uF  CC0603  [C0603]
C80  10uF  C  [C0805]
C81  0.1uF  CC0603  [C0603]
C82  10pF  CC0603  [C0603]
C83  50pF  CC0603  [C0603]
U12  AD5791BRUZ  [SOP65P640X120-20N]
U13  AD8676ARZ  [SOIC127P600X175-8N]

### Nets
+VPWR: C72.2 C73.2 C78.2 C79.2 U12.5(VDD) U13.8(V+) ; also sheet 1,2,3,4,5,6,8,9,10,11,12,13,14
-VPWR: C75.2 C76.2 C80.2 C81.2 U12.18(VSS) U13.4(V-) ; also sheet 1,2,3,4,5,6,8,9,10,11,12,13,14
ANALOG_REF: C77.1 U13.3(+IN_A) ; also sheet 1,3,4,5,6,8,9,10,11,12,13,14
DACO_5: C83.2 U12.2(VOUT) ; also sheet 1
DPWR: C74.2 U12.6(~RESET) U12.7(~CLR) U12.9(VCC) U12.10(IOVCC) ; also sheet 1,2,3,4,5,6,8,9,10,11,12,13,14
GND: C72.1 C73.1 C74.1 C75.1 C76.1 C77.2 C78.1 C79.1 C80.1 C81.1 C83.1 U12.15(DGND) U12.19(AGND) U13.5(+IN_B) ; also sheet 1,2,3,4,5,6,8,9,10,11,12,13,14
INV_5: C82.1 U12.1(INV) ; also sheet 1
LDAC: U12.8(~LDAC) ; also sheet 2,3,4,5,6,8,9,10,11,12,13,14
N$38: U12.4(VREFPF) U13.1(OUT_A)
N$39: U12.16(VREFNF) U13.7(OUT_B)
N$40: U12.3(VREFPS) U13.2(-IN_A)
N$41: U12.17(VREFNS) U13.6(-IN_B)
RFB_5: C82.2 U12.20(RFB) ; also sheet 1
SCLK_5: U12.13(SCLK) ; also sheet 2
SDIN_5: U12.12(SDIN) ; also sheet 2
SDO_5: U12.11(SDO)
SYNC_5: U12.14(~SYNC) ; also sheet 2

## Sheet 8 of 14
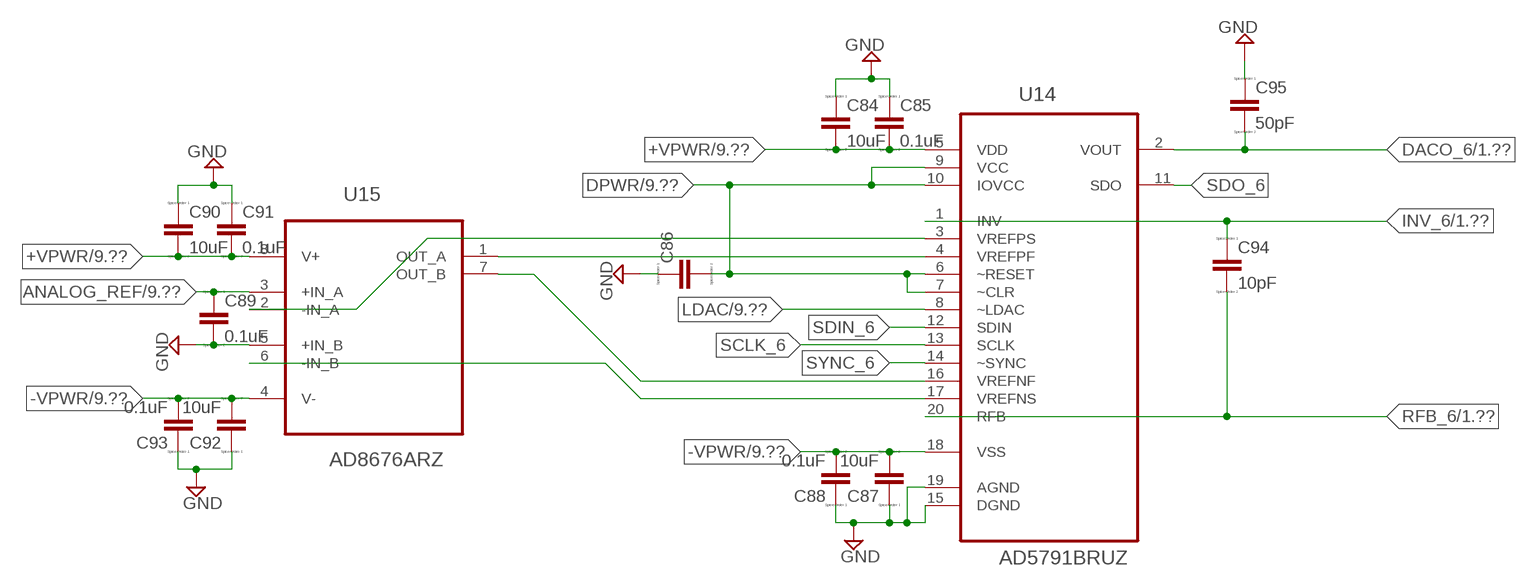
[diagram p8: schematic, sheet 8]

### Parts
C84  10uF  C  [C0805]
C85  0.1uF  CC0603  [C0603]
C86  CC0603  [C0603]
C87  10uF  C  [C0805]
C88  0.1uF  CC0603  [C0603]
C89  0.1uF  CC0603  [C0603]
C90  10uF  C  [C0805]
C91  0.1uF  CC0603  [C0603]
C92  10uF  C  [C0805]
C93  0.1uF  CC0603  [C0603]
C94  10pF  CC0603  [C0603]
C95  50pF  CC0603  [C0603]
U14  AD5791BRUZ  [SOP65P640X120-20N]
U15  AD8676ARZ  [SOIC127P600X175-8N]

### Nets
+VPWR: C84.2 C85.2 C90.2 C91.2 U14.5(VDD) U15.8(V+) ; also sheet 1,2,3,4,5,6,7,9,10,11,12,13,14
-VPWR: C87.2 C88.2 C92.2 C93.2 U14.18(VSS) U15.4(V-) ; also sheet 1,2,3,4,5,6,7,9,10,11,12,13,14
ANALOG_REF: C89.1 U15.3(+IN_A) ; also sheet 1,3,4,5,6,7,9,10,11,12,13,14
DACO_6: C95.2 U14.2(VOUT) ; also sheet 1
DPWR: C86.2 U14.6(~RESET) U14.7(~CLR) U14.9(VCC) U14.10(IOVCC) ; also sheet 1,2,3,4,5,6,7,9,10,11,12,13,14
GND: C84.1 C85.1 C86.1 C87.1 C88.1 C89.2 C90.1 C91.1 C92.1 C93.1 C95.1 U14.15(DGND) U14.19(AGND) U15.5(+IN_B) ; also sheet 1,2,3,4,5,6,7,9,10,11,12,13,14
INV_6: C94.1 U14.1(INV) ; also sheet 1
LDAC: U14.8(~LDAC) ; also sheet 2,3,4,5,6,7,9,10,11,12,13,14
N$45: U14.4(VREFPF) U15.1(OUT_A)
N$46: U14.16(VREFNF) U15.7(OUT_B)
N$47: U14.3(VREFPS) U15.2(-IN_A)
N$48: U14.17(VREFNS) U15.6(-IN_B)
RFB_6: C94.2 U14.20(RFB) ; also sheet 1
SCLK_6: U14.13(SCLK) ; also sheet 2
SDIN_6: U14.12(SDIN) ; also sheet 2
SDO_6: U14.11(SDO)
SYNC_6: U14.14(~SYNC) ; also sheet 2

## Sheet 9 of 14
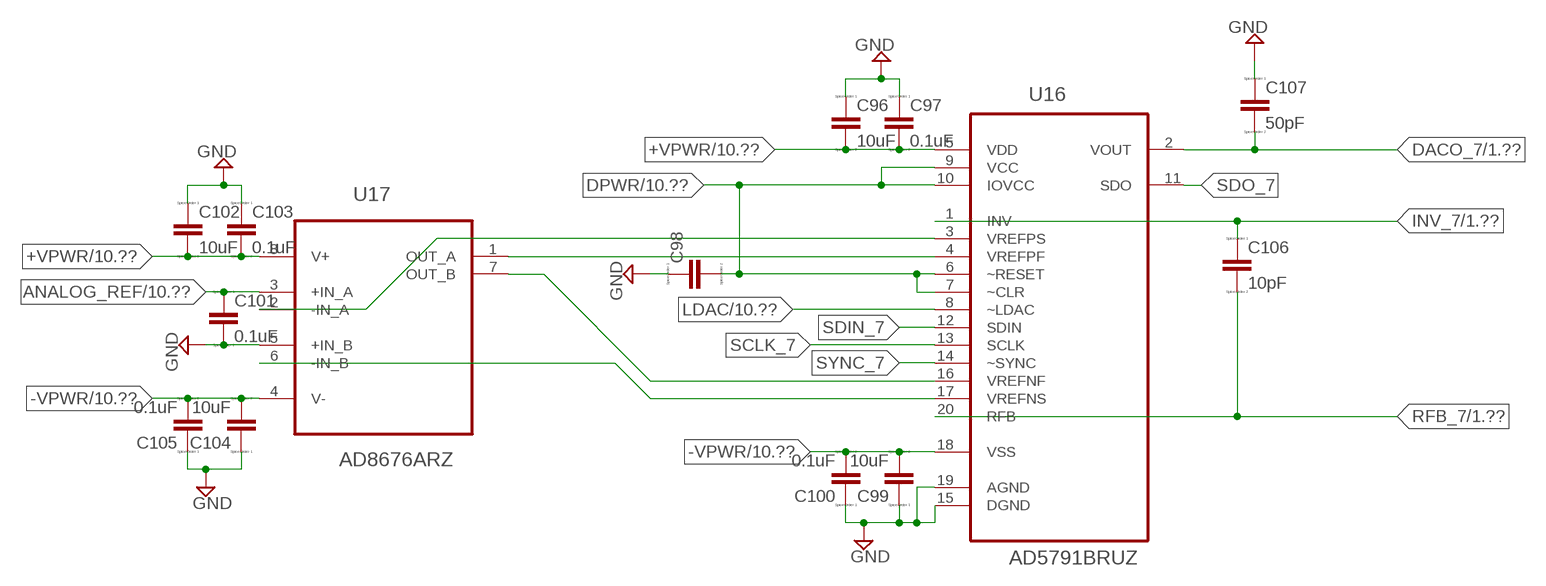
[diagram p9: schematic, sheet 9]

### Parts
C96  10uF  C  [C0805]
C97  0.1uF  CC0603  [C0603]
C98  CC0603  [C0603]
C99  10uF  C  [C0805]
C100  0.1uF  CC0603  [C0603]
C101  0.1uF  CC0603  [C0603]
C102  10uF  C  [C0805]
C103  0.1uF  CC0603  [C0603]
C104  10uF  C  [C0805]
C105  0.1uF  CC0603  [C0603]
C106  10pF  CC0603  [C0603]
C107  50pF  CC0603  [C0603]
U16  AD5791BRUZ  [SOP65P640X120-20N]
U17  AD8676ARZ  [SOIC127P600X175-8N]

### Nets
+VPWR: C96.2 C97.2 C102.2 C103.2 U16.5(VDD) U17.8(V+) ; also sheet 1,2,3,4,5,6,7,8,10,11,12,13,14
-VPWR: C99.2 C100.2 C104.2 C105.2 U16.18(VSS) U17.4(V-) ; also sheet 1,2,3,4,5,6,7,8,10,11,12,13,14
ANALOG_REF: C101.1 U17.3(+IN_A) ; also sheet 1,3,4,5,6,7,8,10,11,12,13,14
DACO_7: C107.2 U16.2(VOUT) ; also sheet 1
DPWR: C98.2 U16.6(~RESET) U16.7(~CLR) U16.9(VCC) U16.10(IOVCC) ; also sheet 1,2,3,4,5,6,7,8,10,11,12,13,14
GND: C96.1 C97.1 C98.1 C99.1 C100.1 C101.2 C102.1 C103.1 C104.1 C105.1 C107.1 U16.15(DGND) U16.19(AGND) U17.5(+IN_B) ; also sheet 1,2,3,4,5,6,7,8,10,11,12,13,14
INV_7: C106.1 U16.1(INV) ; also sheet 1
LDAC: U16.8(~LDAC) ; also sheet 2,3,4,5,6,7,8,10,11,12,13,14
N$52: U16.4(VREFPF) U17.1(OUT_A)
N$53: U16.16(VREFNF) U17.7(OUT_B)
N$54: U16.3(VREFPS) U17.2(-IN_A)
N$57: U16.17(VREFNS) U17.6(-IN_B)
RFB_7: C106.2 U16.20(RFB) ; also sheet 1
SCLK_7: U16.13(SCLK) ; also sheet 2
SDIN_7: U16.12(SDIN) ; also sheet 2
SDO_7: U16.11(SDO)
SYNC_7: U16.14(~SYNC) ; also sheet 2

## Sheet 10 of 14
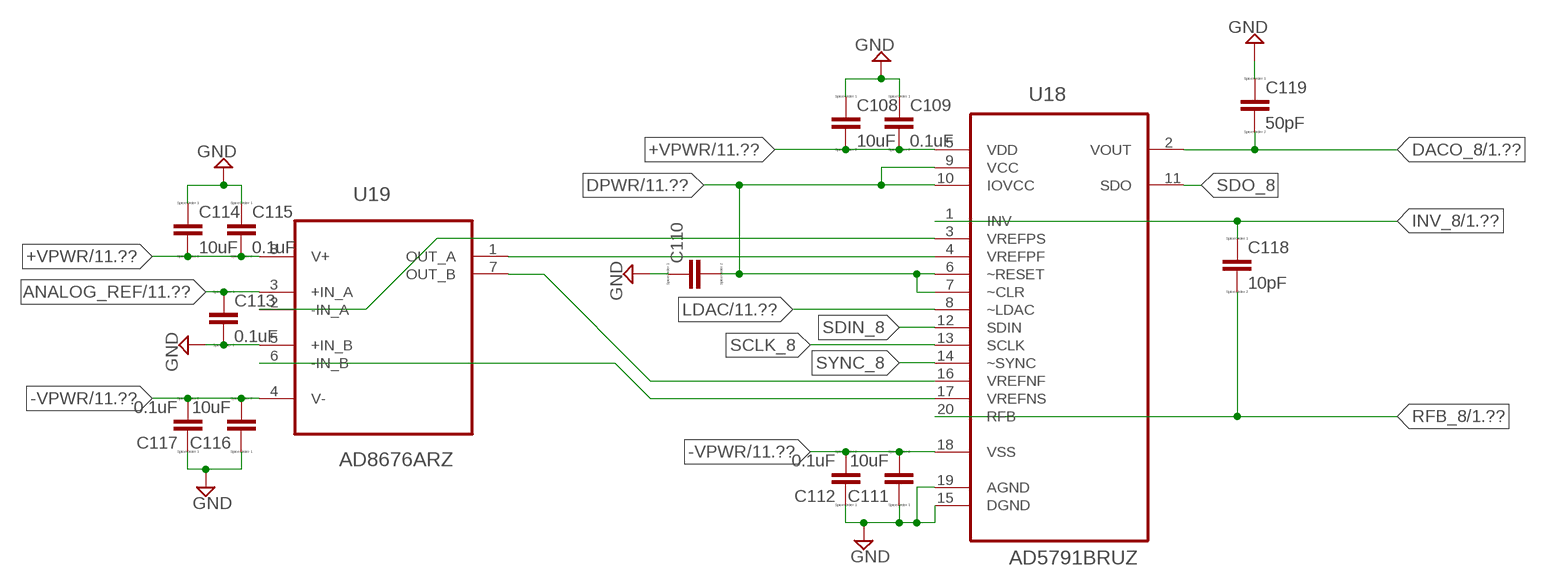
[diagram p10: schematic, sheet 10]

### Parts
C108  10uF  C  [C0805]
C109  0.1uF  CC0603  [C0603]
C110  CC0603  [C0603]
C111  10uF  C  [C0805]
C112  0.1uF  CC0603  [C0603]
C113  0.1uF  CC0603  [C0603]
C114  10uF  C  [C0805]
C115  0.1uF  CC0603  [C0603]
C116  10uF  C  [C0805]
C117  0.1uF  CC0603  [C0603]
C118  10pF  CC0603  [C0603]
C119  50pF  CC0603  [C0603]
U18  AD5791BRUZ  [SOP65P640X120-20N]
U19  AD8676ARZ  [SOIC127P600X175-8N]

### Nets
+VPWR: C108.2 C109.2 C114.2 C115.2 U18.5(VDD) U19.8(V+) ; also sheet 1,2,3,4,5,6,7,8,9,11,12,13,14
-VPWR: C111.2 C112.2 C116.2 C117.2 U18.18(VSS) U19.4(V-) ; also sheet 1,2,3,4,5,6,7,8,9,11,12,13,14
ANALOG_REF: C113.1 U19.3(+IN_A) ; also sheet 1,3,4,5,6,7,8,9,11,12,13,14
DACO_8: C119.2 U18.2(VOUT) ; also sheet 1
DPWR: C110.2 U18.6(~RESET) U18.7(~CLR) U18.9(VCC) U18.10(IOVCC) ; also sheet 1,2,3,4,5,6,7,8,9,11,12,13,14
GND: C108.1 C109.1 C110.1 C111.1 C112.1 C113.2 C114.1 C115.1 C116.1 C117.1 C119.1 U18.15(DGND) U18.19(AGND) U19.5(+IN_B) ; also sheet 1,2,3,4,5,6,7,8,9,11,12,13,14
INV_8: C118.1 U18.1(INV) ; also sheet 1
LDAC: U18.8(~LDAC) ; also sheet 2,3,4,5,6,7,8,9,11,12,13,14
N$63: U18.4(VREFPF) U19.1(OUT_A)
N$64: U18.16(VREFNF) U19.7(OUT_B)
N$65: U18.3(VREFPS) U19.2(-IN_A)
N$66: U18.17(VREFNS) U19.6(-IN_B)
RFB_8: C118.2 U18.20(RFB) ; also sheet 1
SCLK_8: U18.13(SCLK) ; also sheet 2
SDIN_8: U18.12(SDIN) ; also sheet 2
SDO_8: U18.11(SDO)
SYNC_8: U18.14(~SYNC) ; also sheet 2

## Sheet 11 of 14
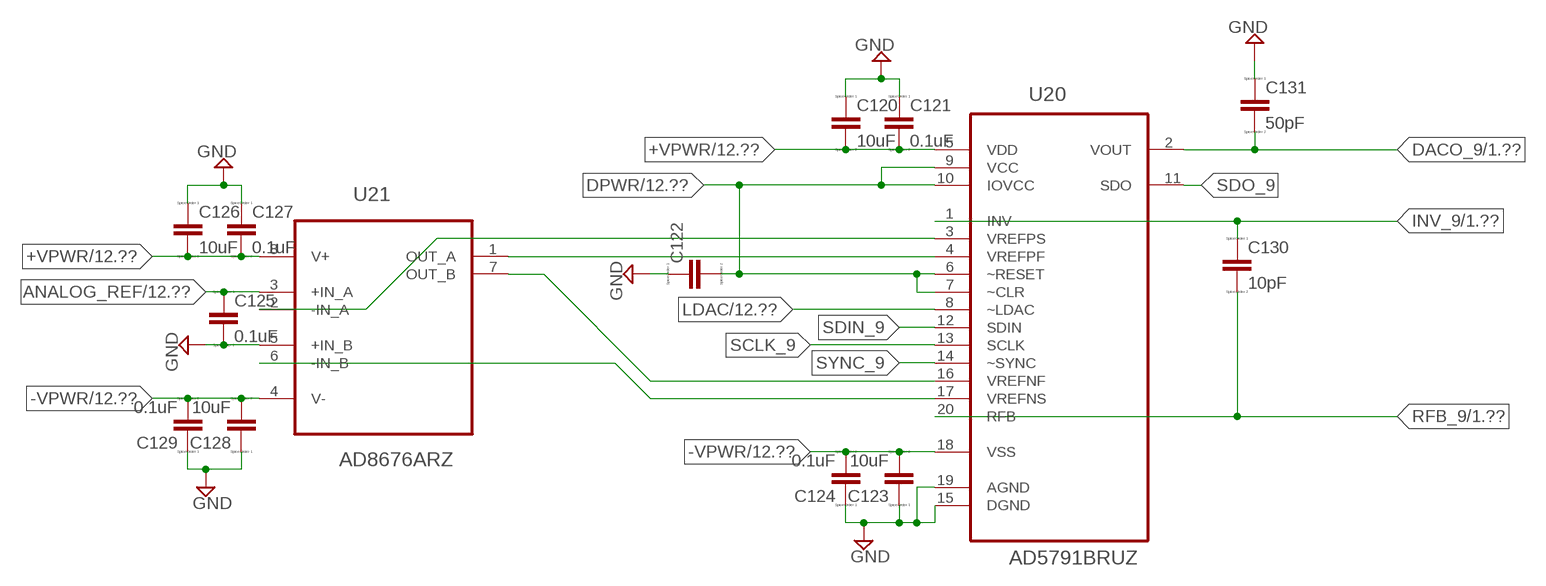
[diagram p11: schematic, sheet 11]

### Parts
C120  10uF  C  [C0805]
C121  0.1uF  CC0603  [C0603]
C122  CC0603  [C0603]
C123  10uF  C  [C0805]
C124  0.1uF  CC0603  [C0603]
C125  0.1uF  CC0603  [C0603]
C126  10uF  C  [C0805]
C127  0.1uF  CC0603  [C0603]
C128  10uF  C  [C0805]
C129  0.1uF  CC0603  [C0603]
C130  10pF  CC0603  [C0603]
C131  50pF  CC0603  [C0603]
U20  AD5791BRUZ  [SOP65P640X120-20N]
U21  AD8676ARZ  [SOIC127P600X175-8N]

### Nets
+VPWR: C120.2 C121.2 C126.2 C127.2 U20.5(VDD) U21.8(V+) ; also sheet 1,2,3,4,5,6,7,8,9,10,12,13,14
-VPWR: C123.2 C124.2 C128.2 C129.2 U20.18(VSS) U21.4(V-) ; also sheet 1,2,3,4,5,6,7,8,9,10,12,13,14
ANALOG_REF: C125.1 U21.3(+IN_A) ; also sheet 1,3,4,5,6,7,8,9,10,12,13,14
DACO_9: C131.2 U20.2(VOUT) ; also sheet 1
DPWR: C122.2 U20.6(~RESET) U20.7(~CLR) U20.9(VCC) U20.10(IOVCC) ; also sheet 1,2,3,4,5,6,7,8,9,10,12,13,14
GND: C120.1 C121.1 C122.1 C123.1 C124.1 C125.2 C126.1 C127.1 C128.1 C129.1 C131.1 U20.15(DGND) U20.19(AGND) U21.5(+IN_B) ; also sheet 1,2,3,4,5,6,7,8,9,10,12,13,14
INV_9: C130.1 U20.1(INV) ; also sheet 1
LDAC: U20.8(~LDAC) ; also sheet 2,3,4,5,6,7,8,9,10,12,13,14
N$70: U20.4(VREFPF) U21.1(OUT_A)
N$71: U20.16(VREFNF) U21.7(OUT_B)
N$72: U20.3(VREFPS) U21.2(-IN_A)
N$73: U20.17(VREFNS) U21.6(-IN_B)
RFB_9: C130.2 U20.20(RFB) ; also sheet 1
SCLK_9: U20.13(SCLK) ; also sheet 2
SDIN_9: U20.12(SDIN) ; also sheet 2
SDO_9: U20.11(SDO)
SYNC_9: U20.14(~SYNC) ; also sheet 2

## Sheet 12 of 14
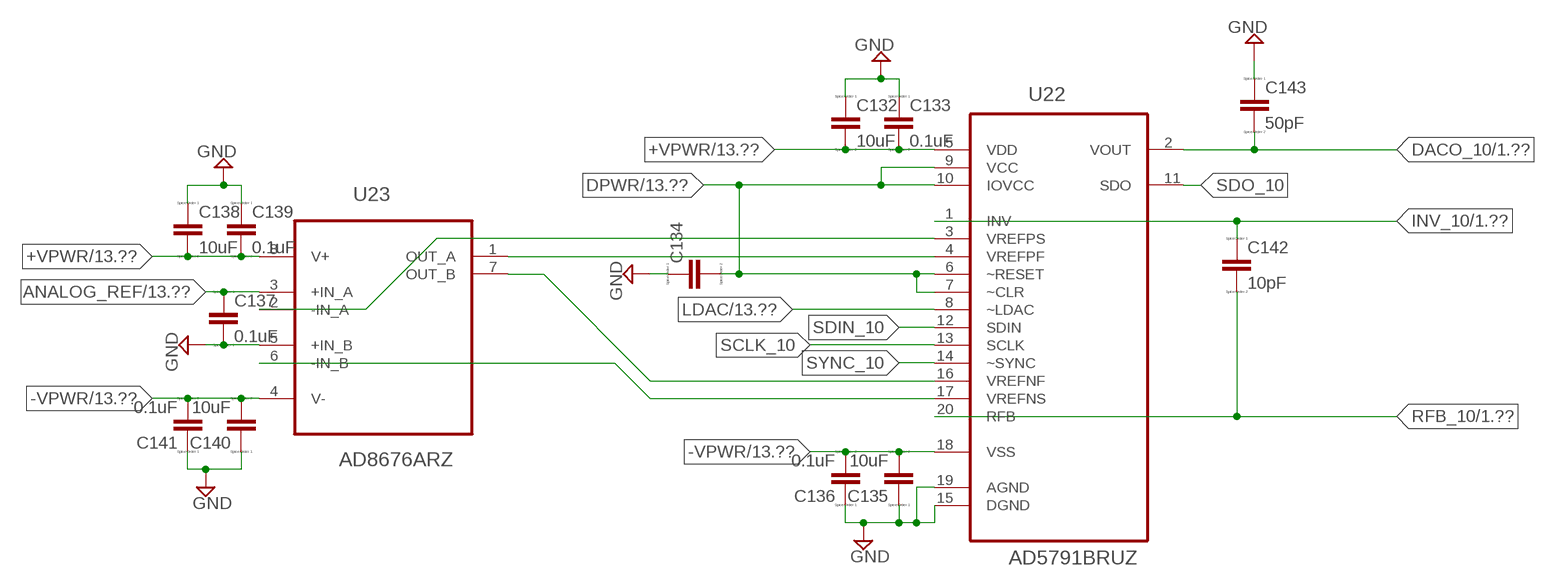
[diagram p12: schematic, sheet 12]

### Parts
C132  10uF  C  [C0805]
C133  0.1uF  CC0603  [C0603]
C134  CC0603  [C0603]
C135  10uF  C  [C0805]
C136  0.1uF  CC0603  [C0603]
C137  0.1uF  CC0603  [C0603]
C138  10uF  C  [C0805]
C139  0.1uF  CC0603  [C0603]
C140  10uF  C  [C0805]
C141  0.1uF  CC0603  [C0603]
C142  10pF  CC0603  [C0603]
C143  50pF  CC0603  [C0603]
U22  AD5791BRUZ  [SOP65P640X120-20N]
U23  AD8676ARZ  [SOIC127P600X175-8N]

### Nets
+VPWR: C132.2 C133.2 C138.2 C139.2 U22.5(VDD) U23.8(V+) ; also sheet 1,2,3,4,5,6,7,8,9,10,11,13,14
-VPWR: C135.2 C136.2 C140.2 C141.2 U22.18(VSS) U23.4(V-) ; also sheet 1,2,3,4,5,6,7,8,9,10,11,13,14
ANALOG_REF: C137.1 U23.3(+IN_A) ; also sheet 1,3,4,5,6,7,8,9,10,11,13,14
DACO_10: C143.2 U22.2(VOUT) ; also sheet 1
DPWR: C134.2 U22.6(~RESET) U22.7(~CLR) U22.9(VCC) U22.10(IOVCC) ; also sheet 1,2,3,4,5,6,7,8,9,10,11,13,14
GND: C132.1 C133.1 C134.1 C135.1 C136.1 C137.2 C138.1 C139.1 C140.1 C141.1 C143.1 U22.15(DGND) U22.19(AGND) U23.5(+IN_B) ; also sheet 1,2,3,4,5,6,7,8,9,10,11,13,14
INV_10: C142.1 U22.1(INV) ; also sheet 1
LDAC: U22.8(~LDAC) ; also sheet 2,3,4,5,6,7,8,9,10,11,13,14
N$77: U22.4(VREFPF) U23.1(OUT_A)
N$78: U22.16(VREFNF) U23.7(OUT_B)
N$79: U22.3(VREFPS) U23.2(-IN_A)
N$80: U22.17(VREFNS) U23.6(-IN_B)
RFB_10: C142.2 U22.20(RFB) ; also sheet 1
SCLK_10: U22.13(SCLK) ; also sheet 2
SDIN_10: U22.12(SDIN) ; also sheet 2
SDO_10: U22.11(SDO)
SYNC_10: U22.14(~SYNC) ; also sheet 2

## Sheet 13 of 14
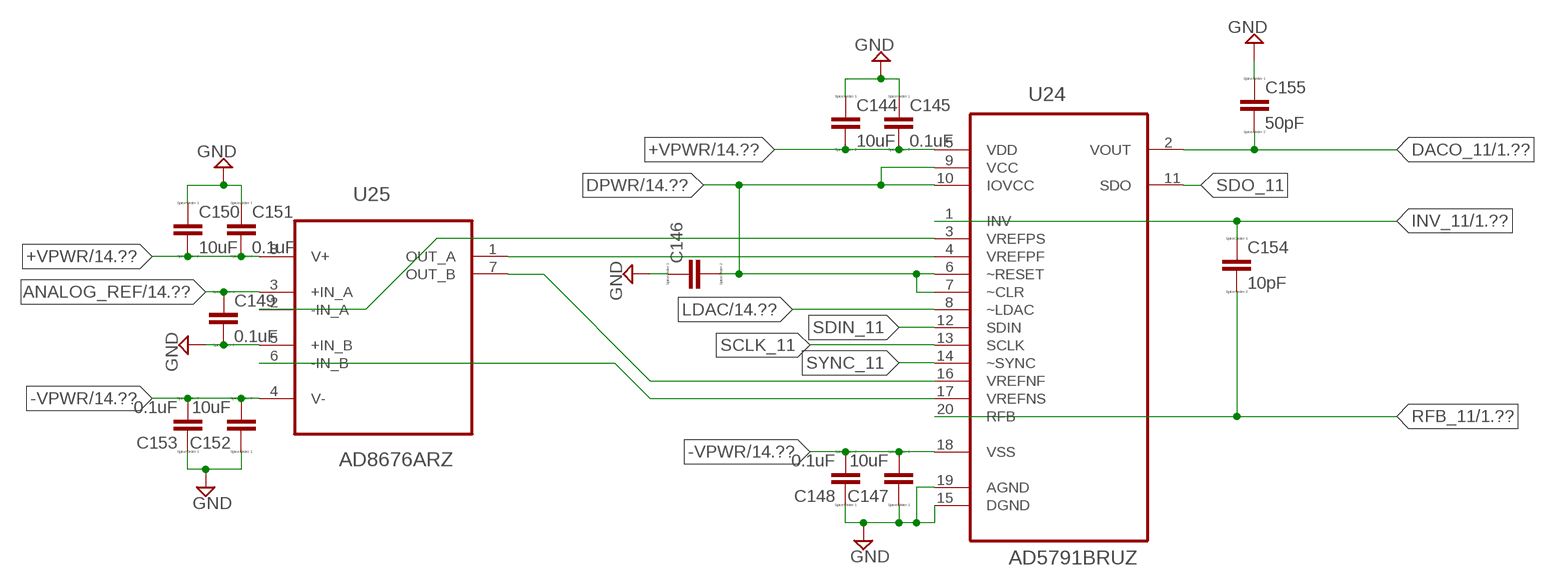
[diagram p13: schematic, sheet 13]

### Parts
C144  10uF  C  [C0805]
C145  0.1uF  CC0603  [C0603]
C146  CC0603  [C0603]
C147  10uF  C  [C0805]
C148  0.1uF  CC0603  [C0603]
C149  0.1uF  CC0603  [C0603]
C150  10uF  C  [C0805]
C151  0.1uF  CC0603  [C0603]
C152  10uF  C  [C0805]
C153  0.1uF  CC0603  [C0603]
C154  10pF  CC0603  [C0603]
C155  50pF  CC0603  [C0603]
U24  AD5791BRUZ  [SOP65P640X120-20N]
U25  AD8676ARZ  [SOIC127P600X175-8N]

### Nets
+VPWR: C144.2 C145.2 C150.2 C151.2 U24.5(VDD) U25.8(V+) ; also sheet 1,2,3,4,5,6,7,8,9,10,11,12,14
-VPWR: C147.2 C148.2 C152.2 C153.2 U24.18(VSS) U25.4(V-) ; also sheet 1,2,3,4,5,6,7,8,9,10,11,12,14
ANALOG_REF: C149.1 U25.3(+IN_A) ; also sheet 1,3,4,5,6,7,8,9,10,11,12,14
DACO_11: C155.2 U24.2(VOUT) ; also sheet 1
DPWR: C146.2 U24.6(~RESET) U24.7(~CLR) U24.9(VCC) U24.10(IOVCC) ; also sheet 1,2,3,4,5,6,7,8,9,10,11,12,14
GND: C144.1 C145.1 C146.1 C147.1 C148.1 C149.2 C150.1 C151.1 C152.1 C153.1 C155.1 U24.15(DGND) U24.19(AGND) U25.5(+IN_B) ; also sheet 1,2,3,4,5,6,7,8,9,10,11,12,14
INV_11: C154.1 U24.1(INV) ; also sheet 1
LDAC: U24.8(~LDAC) ; also sheet 2,3,4,5,6,7,8,9,10,11,12,14
N$84: U24.4(VREFPF) U25.1(OUT_A)
N$85: U24.16(VREFNF) U25.7(OUT_B)
N$86: U24.3(VREFPS) U25.2(-IN_A)
N$87: U24.17(VREFNS) U25.6(-IN_B)
RFB_11: C154.2 U24.20(RFB) ; also sheet 1
SCLK_11: U24.13(SCLK) ; also sheet 2
SDIN_11: U24.12(SDIN) ; also sheet 2
SDO_11: U24.11(SDO)
SYNC_11: U24.14(~SYNC) ; also sheet 2

## Sheet 14 of 14
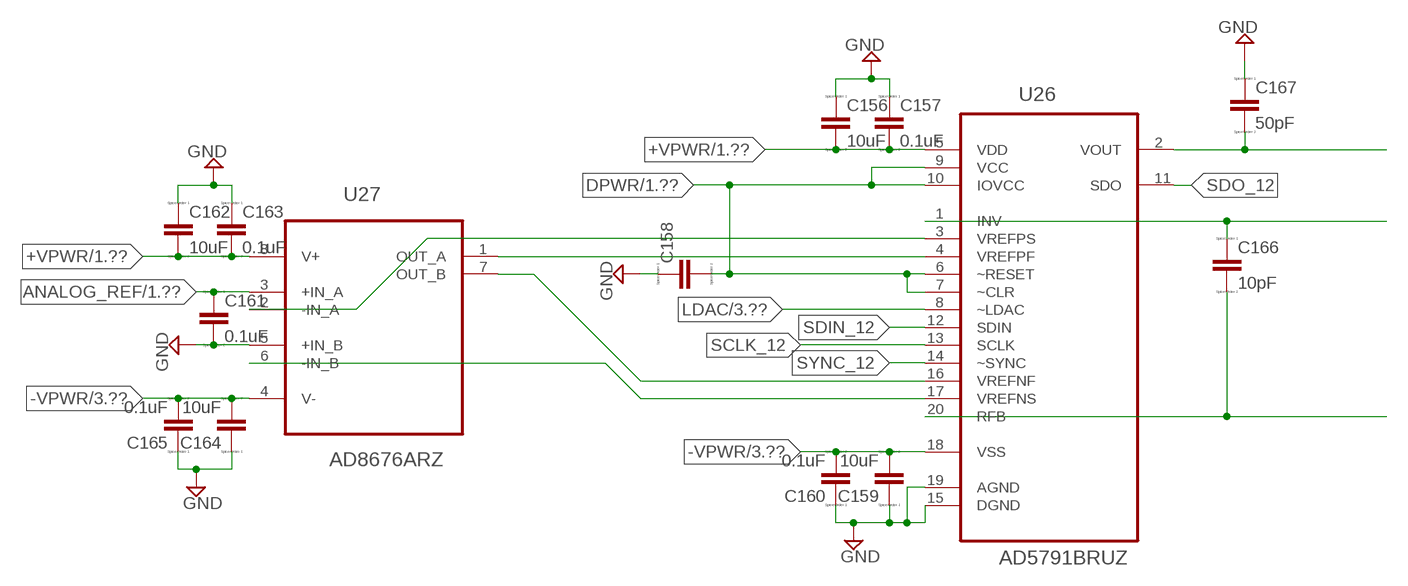
[diagram p14: schematic, sheet 14]

### Parts
C156  10uF  C  [C0805]
C157  0.1uF  CC0603  [C0603]
C158  CC0603  [C0603]
C159  10uF  C  [C0805]
C160  0.1uF  CC0603  [C0603]
C161  0.1uF  CC0603  [C0603]
C162  10uF  C  [C0805]
C163  0.1uF  CC0603  [C0603]
C164  10uF  C  [C0805]
C165  0.1uF  CC0603  [C0603]
C166  10pF  CC0603  [C0603]
C167  50pF  CC0603  [C0603]
U26  AD5791BRUZ  [SOP65P640X120-20N]
U27  AD8676ARZ  [SOIC127P600X175-8N]

### Nets
+VPWR: C156.2 C157.2 C162.2 C163.2 U26.5(VDD) U27.8(V+) ; also sheet 1,2,3,4,5,6,7,8,9,10,11,12,13
-VPWR: C159.2 C160.2 C164.2 C165.2 U26.18(VSS) U27.4(V-) ; also sheet 1,2,3,4,5,6,7,8,9,10,11,12,13
ANALOG_REF: C161.1 U27.3(+IN_A) ; also sheet 1,3,4,5,6,7,8,9,10,11,12,13
DACO_12: C167.2 U26.2(VOUT) ; also sheet 1
DPWR: C158.2 U26.6(~RESET) U26.7(~CLR) U26.9(VCC) U26.10(IOVCC) ; also sheet 1,2,3,4,5,6,7,8,9,10,11,12,13
GND: C156.1 C157.1 C158.1 C159.1 C160.1 C161.2 C162.1 C163.1 C164.1 C165.1 C167.1 U26.15(DGND) U26.19(AGND) U27.5(+IN_B) ; also sheet 1,2,3,4,5,6,7,8,9,10,11,12,13
INV_12: C166.1 U26.1(INV) ; also sheet 1
LDAC: U26.8(~LDAC) ; also sheet 2,3,4,5,6,7,8,9,10,11,12,13
N$91: U26.4(VREFPF) U27.1(OUT_A)
N$92: U26.16(VREFNF) U27.7(OUT_B)
N$93: U26.3(VREFPS) U27.2(-IN_A)
N$94: U26.17(VREFNS) U27.6(-IN_B)
RFB_12: C166.2 U26.20(RFB) ; also sheet 1
SCLK_12: U26.13(SCLK) ; also sheet 2
SDIN_12: U26.12(SDIN) ; also sheet 2
SDO_12: U26.11(SDO)
SYNC_12: U26.14(~SYNC) ; also sheet 2

## Library data of the parts
560Ω R4 R5 R8-R29 = eagle-ltspice:R: RESISTOR, European symbol; SPICEMODEL: NONE; SPICEPREFIX: R
C1-C22 C26-C201 = eagle-ltspice:C: CAPACITOR, European symbol; SPICEMODEL: NONE; SPICEPREFIX: C
C23-C25 = rcl:C-EU: CAPACITOR, European symbol
ISO1-ISO11 = Rich:SI-SI8655: Silicon Labs low power five-channel digital isolator (5 in, 0 out, no enables).
J1 = Rich:EUROCARD-CPCI-220: 220-pin Compact-PCI Eurocard connectors (backplane and card outline packages)
JP2 JP3 = jumper:JP6Q: JUMPER
R1-R3 R6 R7 = rcl:R-US_: RESISTOR, American symbol
U1 = Rich:TI-SN74GTLP1395: Two 1-Bit LVTTL/GTLP Adj-Edge-Rate Bus Xcvrs w Split LVTTL Port, Fdbk Path and Selectable Polarity
U2 U3 = Rich:TI-SN74GTLPH16912: 18-Bit LVTTL-to-GTLP Universal Bus Transceiver
U4 U6 U8 U10 U12 U14 U16 U18 U20 U22 U24 U26 = Analog Devices_By_element14_Batch_1:AD5791BRUZ: DAC; MPN: AD5791BRUZ; OC_FARNELL: -; OC_NEWARK: 85R6432; PACKAGE: TSSOP-20; SUPPLIER: Analog Devices
U5 U7 U9 U11 U13 U15 U17 U19 U21 U23 U25 U27 = Analog Devices_By_element14_Batch_1:AD8676ARZ: Ultraprecision, 36 V, 2.8 nV/ãHz Dual Rail-to-Rail Output Op Amp; MPN: AD8676ARZ; OC_FARNELL: 1316453; OC_NEWARK: 28M4146; PACKAGE: SOIC-8; SUPPLIER: Analog Devices
U28 = Analog Devices_By_element14_Batch_1:AD581KH: High Precision 10 V IC Reference; MPN: AD581KH; OC_FARNELL: 4414640; OC_NEWARK: 05F7034; PACKAGE: TO-5-3; SUPPLIER: Analog Devices
U29 = ADI-Phase-2:ADP3339AKCZ-3.3-R7: Low Dropout Regulator; MPN: ADP3339AKCZ-3.3-R7; OC_FARNELL: 2112615; OC_NEWARK: 12M8168; PACKAGE: SOT-223-3; SUPPLIER: Analog Devices
U30-U35 = Analog Devices_By_element14_Batch_1:AD8620ARZ: Precision, Very Low Noise,Low Input Bias Current, Wide Bandwidth JFET Operational Amplifiers; MPN: AD8620ARZ; OC_FARNELL: 9994386; OC_NEWARK: 59K6972; PACKAGE: SOIC-8; SUPPLIER: Analog Devices
U40 = Rich:TI-SN74GTLPH1655: 16-Bit LVTTL-To-GTLP Adjustable-Edge-Rate Universal Bus Transceiver
X1 = con-subd:F50HP: SUB-D; OC_FARNELL: unknown; OC_NEWARK: unknown